# Altium project NORA_V0.01.PrjPcb
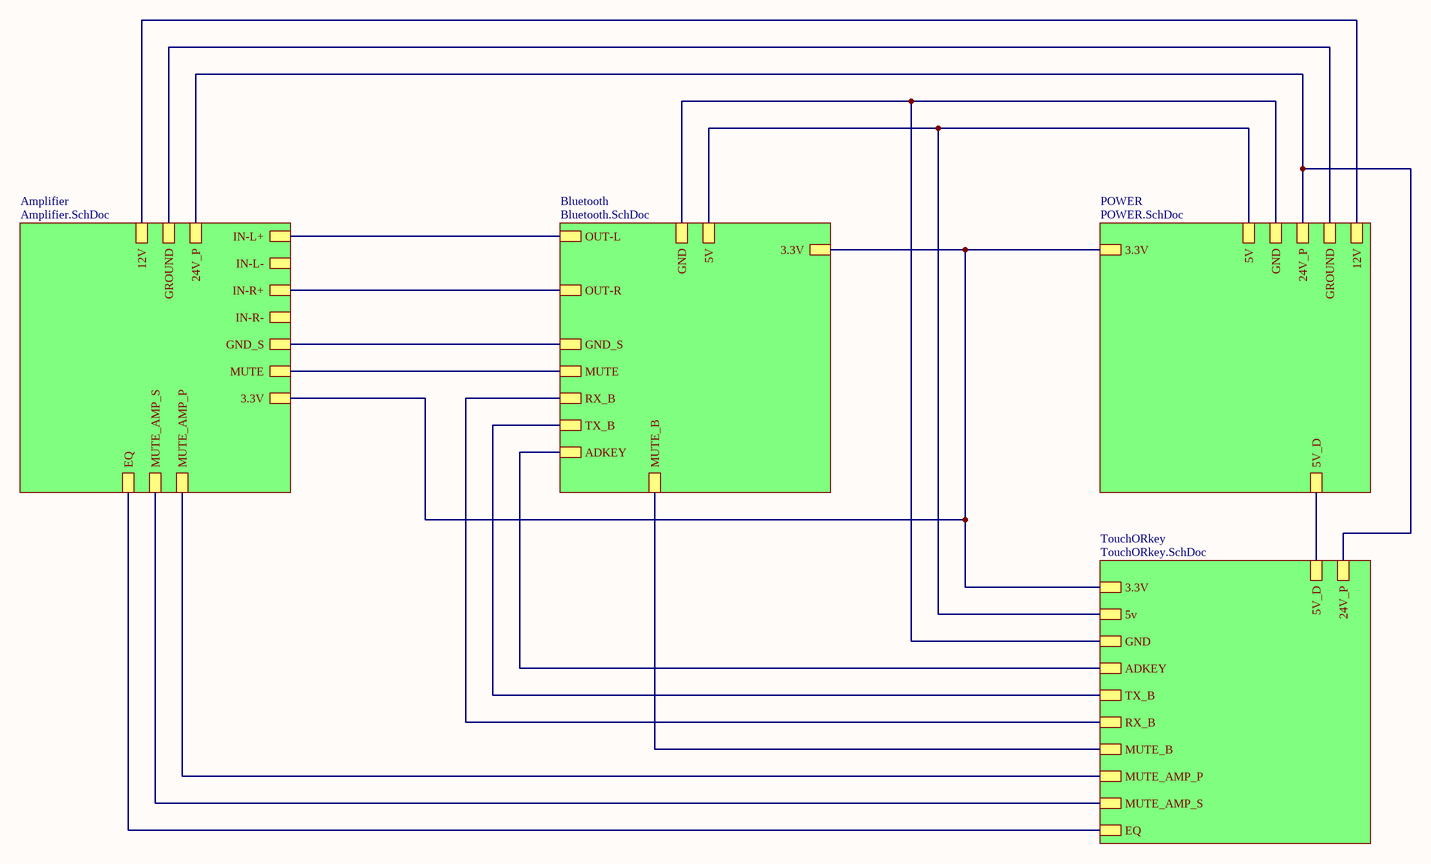
[diagram p0: NORA_V0.01.SchDoc]
5 sheets, 370 parts. Net scope: hierarchical (ports join the sheet entries above them; power ports are global).
Board files: NORA_V0.01-Pannel.PcbDoc, NORA_V0.01.PcbDoc
Sheets:
  NORA_V0.01.SchDoc
    Amplifier = Amplifier.SchDoc
    Bluetooth = Bluetooth.SchDoc
    POWER = POWER.SchDoc
    TouchORkey = TouchORkey.SchDoc

## Sheet NORA_V0.01.SchDoc
size A3; Value: 13nH

### Sub-sheets
Amplifier = Amplifier.SchDoc: IN-L+, IN-L-, IN-R+, IN-R-, MUTE, 24V_P, GROUND, GND_S, 3.3V, 12V, MUTE_AMP_P, MUTE_AMP_S, EQ
Bluetooth = Bluetooth.SchDoc: OUT-L, OUT-R, 3.3V, GND_S, GND, 5V, MUTE, RX_B, TX_B, ADKEY, MUTE_B
POWER = POWER.SchDoc: 3.3V, GND, 5V, 24V_P, GROUND, 12V, 5V_D
TouchORkey = TouchORkey.SchDoc: ADKEY, 3.3V, 5v, GND, TX_B, RX_B, 5V_D, 24V_P, MUTE_AMP_S, MUTE_B, MUTE_AMP_P, EQ

### Nets
3.3V: sheet Amplifier/3.3V, sheet Bluetooth/3.3V, sheet POWER/3.3V, sheet TouchORkey/3.3V
5V_D: sheet POWER/5V_D, sheet TouchORkey/5V_D
12V: sheet Amplifier/12V, sheet POWER/12V
24V_P: sheet Amplifier/24V_P, sheet POWER/24V_P, sheet TouchORkey/24V_P
AGND: sheet Amplifier/GND_S, sheet Bluetooth/GND_S
GND: sheet Amplifier/GROUND, sheet Bluetooth/GND, sheet POWER/GND, sheet POWER/GROUND, sheet TouchORkey/GND
VPWR: sheet Bluetooth/5V, sheet POWER/5V, sheet TouchORkey/5v
ADKEY: sheet Bluetooth/ADKEY, sheet TouchORkey/ADKEY
DACL: sheet Amplifier/IN-L+, sheet Bluetooth/OUT-L
DACR: sheet Amplifier/IN-R+, sheet Bluetooth/OUT-R
EQ: sheet Amplifier/EQ, sheet TouchORkey/EQ
IO0: sheet Bluetooth/MUTE_B, sheet TouchORkey/MUTE_B
IO3: sheet Amplifier/MUTE_AMP_P, sheet TouchORkey/MUTE_AMP_P
IO6: sheet Amplifier/MUTE_AMP_S, sheet TouchORkey/MUTE_AMP_S
IO20: sheet Bluetooth/TX_B, sheet TouchORkey/TX_B
IO21: sheet Bluetooth/RX_B, sheet TouchORkey/RX_B
MUTE: sheet Amplifier/MUTE, sheet Bluetooth/MUTE

### Notes on the sheet
- Title
- Size:
- Date:
- A3
- Number:
- Time:
- Revision:
- Sheet
- of
- File:

## Sheet Amplifier.SchDoc
size 863 x 558 mm
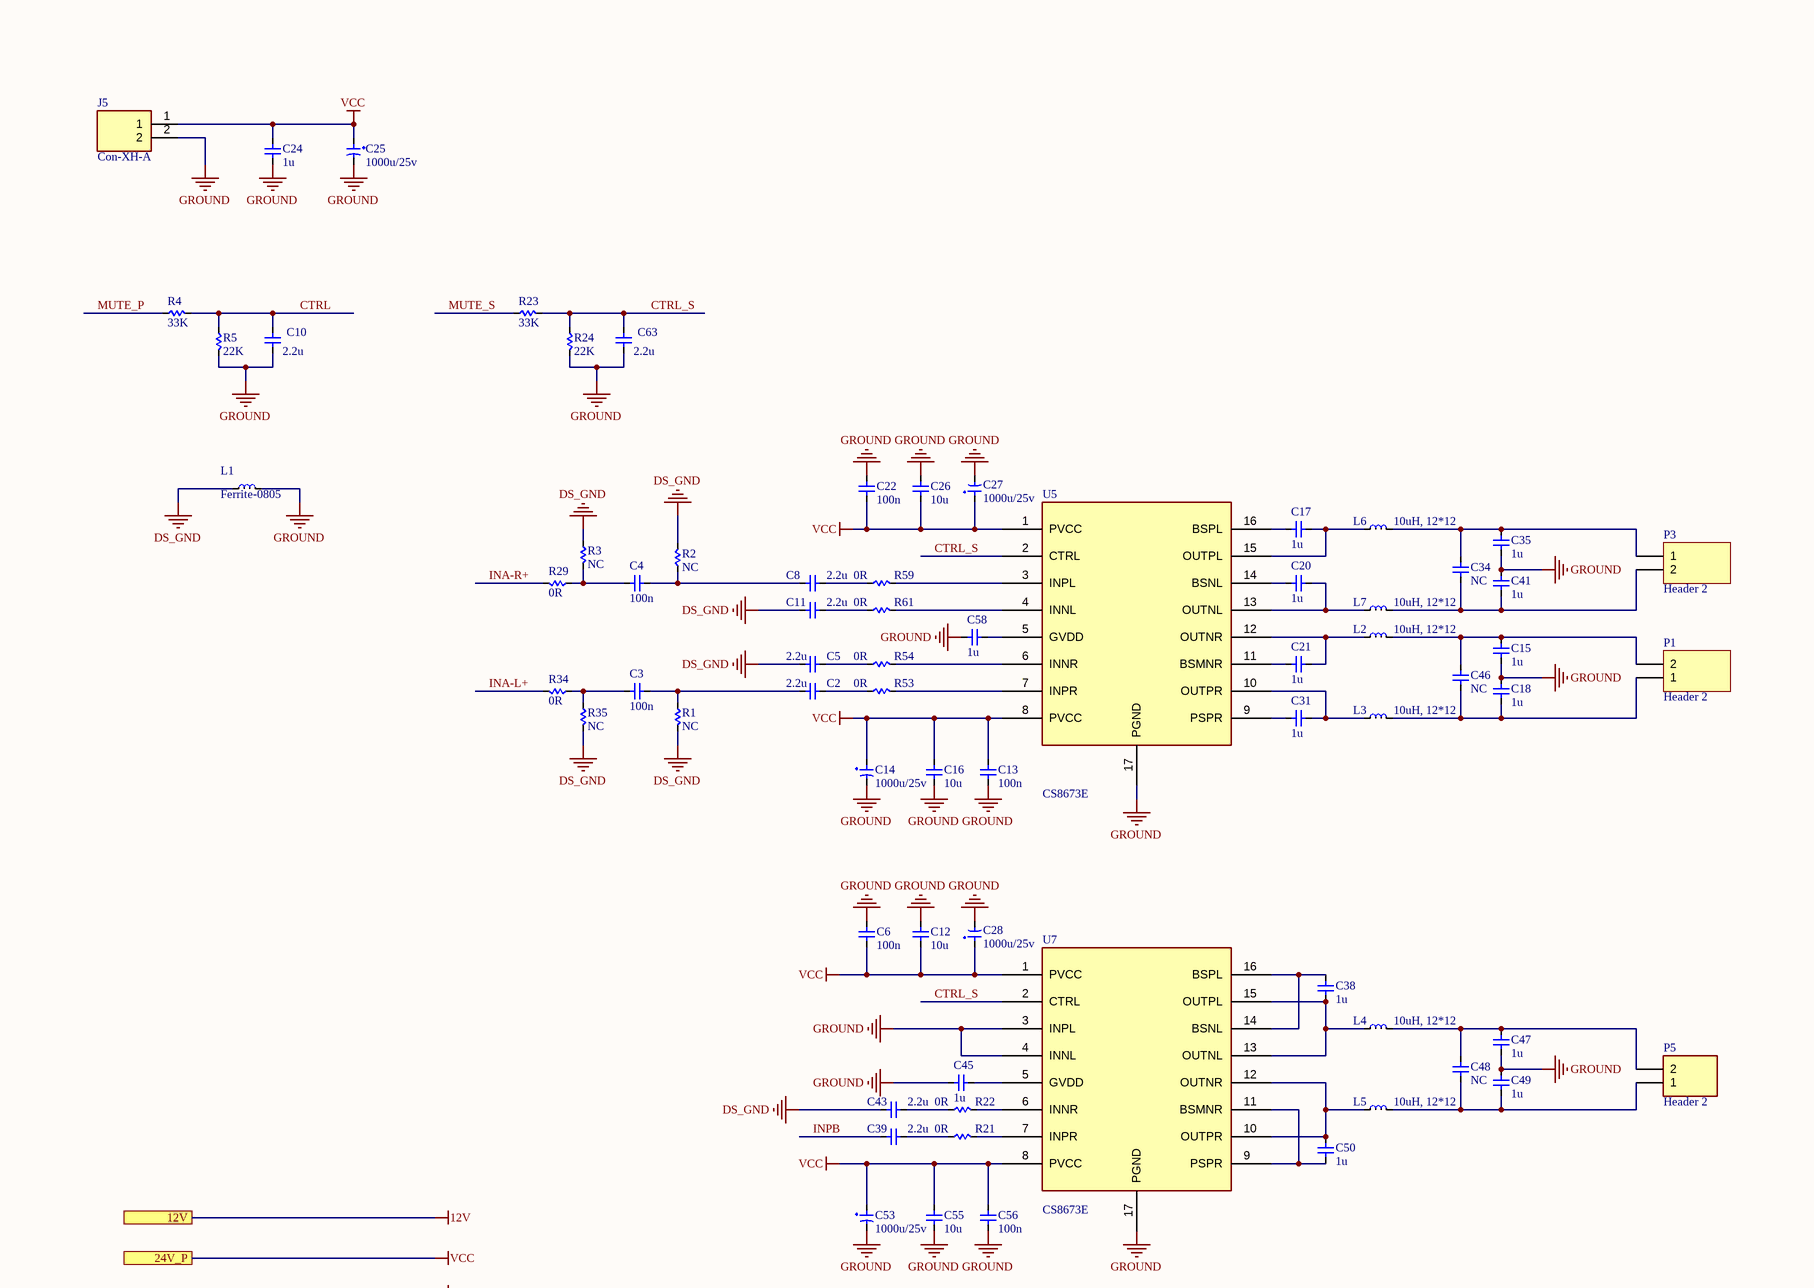
[diagram p1: Amplifier.SchDoc, top left]
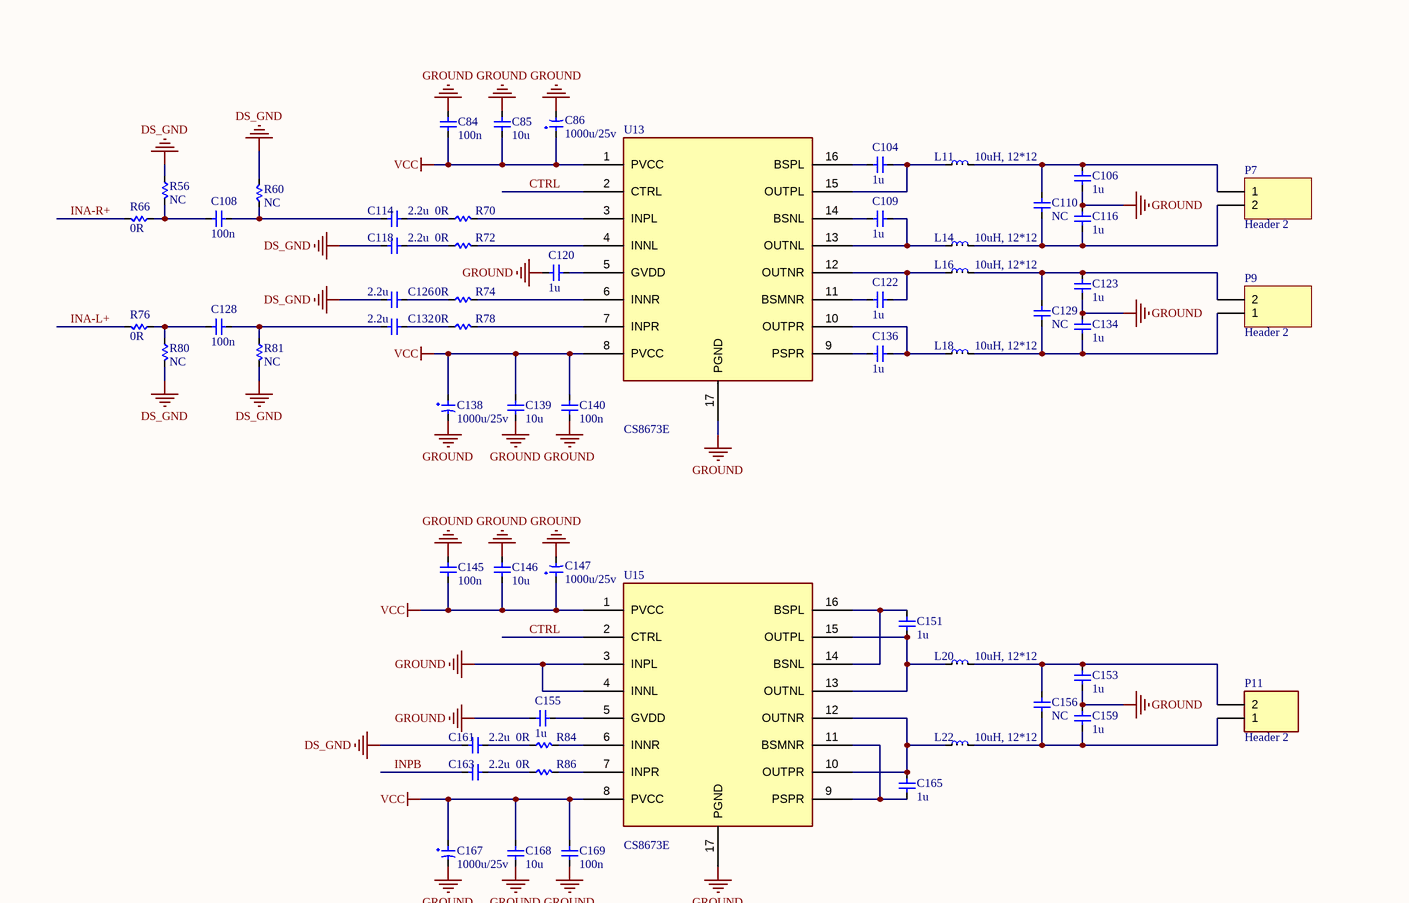
[diagram p2: Amplifier.SchDoc, top middle]
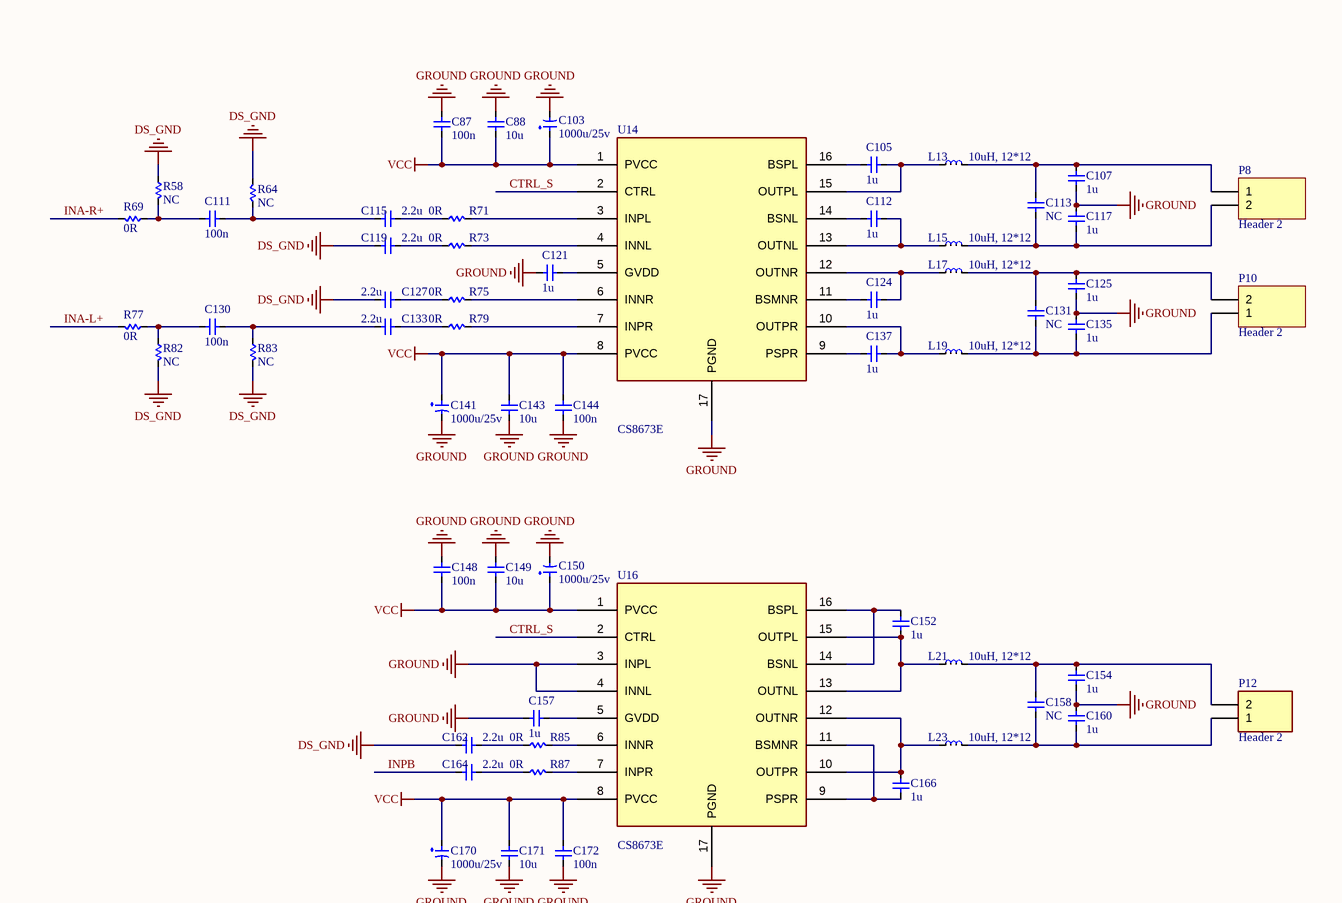
[diagram p3: Amplifier.SchDoc, top right]
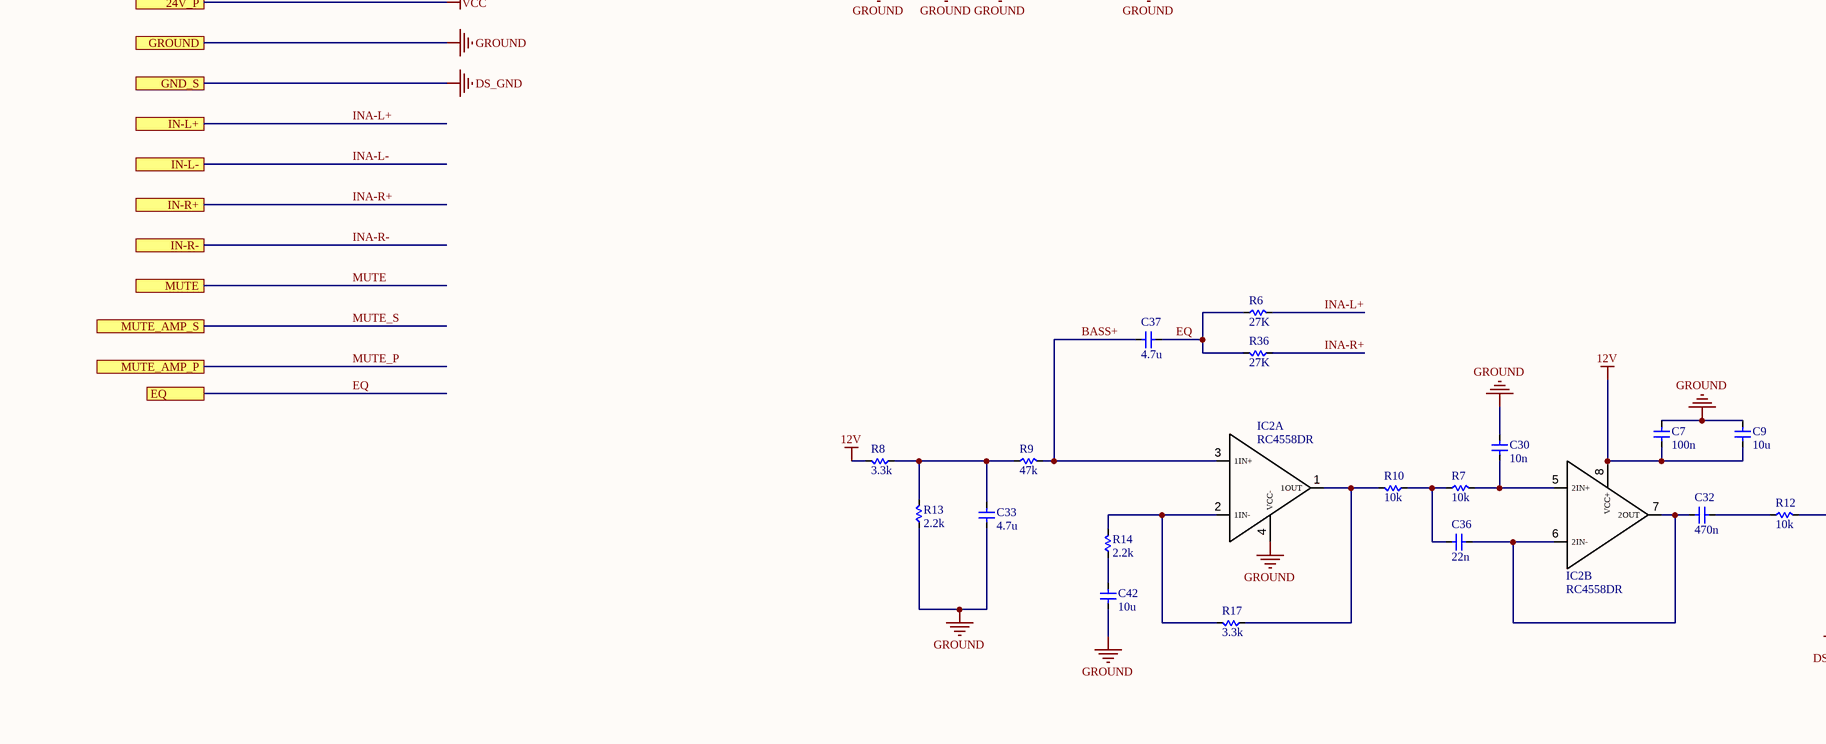
[diagram p4: Amplifier.SchDoc, bottom left]
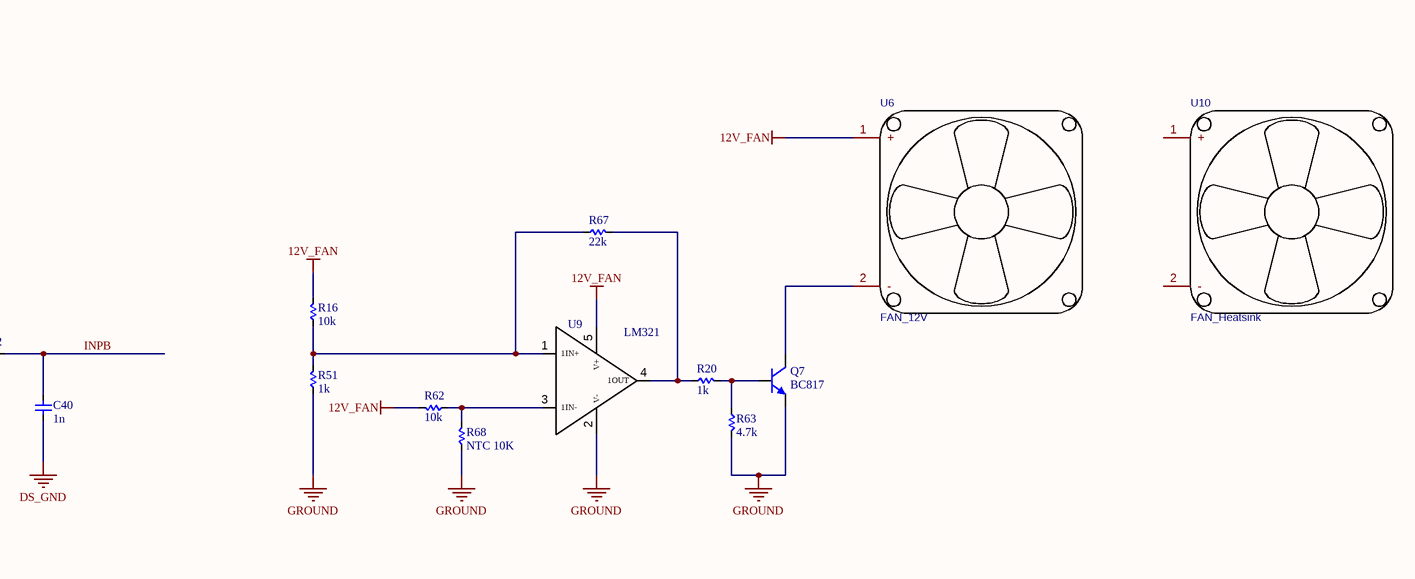
[diagram p5: Amplifier.SchDoc, bottom middle]

### Parts
C2  2.2u  [cap0603]
C3  100n  [cap0603]
C4  100n  [cap0603]
C5  2.2u  [cap0603]
C6  100n  [cap0603]
C7  100n  [cap0603]
C8  2.2u  [cap0603]
C9  10u  [cap0603]
C10  2.2u  [cap0603]
C11  2.2u  [cap0603]
C12  10u  [CAP 0805]
C13  100n  [cap0603]
C14  1000u/25v  [CAP DIP 10*13]
C15  1u  [CAP 0805]
C16  10u  [CAP 0805]
C17  1u  [CAP 0805]
C18  1u  [CAP 0805]
C20  1u  [CAP 0805]
C21  1u  [CAP 0805]
C22  100n  [cap0603]
C24  1u  [cap0603]
C25  1000u/25v  [CAP DIP 10*13]
C26  10u  [CAP 0805]
C27  1000u/25v  [CAP DIP 10*13]
C28  1000u/25v  [CAP DIP 10*13]
C30  10n  [cap0603]
C31  1u  [CAP 0805]
C32  470n  [cap0603]
C33  4.7u  [cap0603]
C34  NC  [CAP 0805]
C35  1u  [CAP 0805]
C36  22n  [cap0603]
C37  4.7u  [cap0603]
C38  1u  [CAP 0805]
C39  2.2u  [cap0603]
C40  1n  [cap0603]
C41  1u  [CAP 0805]
C42  10u  [CAP 1206]
C43  2.2u  [cap0603]
C45  1u  [cap0603]
C46  NC  [CAP 0805]
C47  1u  [CAP 0805]
C48  NC  [CAP 0805]
C49  1u  [CAP 0805]
C50  1u  [CAP 0805]
C53  1000u/25v  [CAP DIP 10*13]
C55  10u  [CAP 0805]
C56  100n  [cap0603]
C58  1u  [cap0603]
C63  2.2u  [cap0603]
C84  100n  [cap0603]
C85  10u  [CAP 0805]
C86  1000u/25v  [CAP DIP 10*13]
C87  100n  [cap0603]
C88  10u  [CAP 0805]
C103  1000u/25v  [CAP DIP 10*13]
C104  1u  [CAP 0805]
C105  1u  [CAP 0805]
C106  1u  [CAP 0805]
C107  1u  [CAP 0805]
C108  100n  [cap0603]
C109  1u  [CAP 0805]
C110  NC  [CAP 0805]
C111  100n  [cap0603]
C112  1u  [CAP 0805]
C113  NC  [CAP 0805]
C114  2.2u  [cap0603]
C115  2.2u  [cap0603]
C116  1u  [CAP 0805]
C117  1u  [CAP 0805]
C118  2.2u  [cap0603]
C119  2.2u  [cap0603]
C120  1u  [cap0603]
C121  1u  [cap0603]
C122  1u  [CAP 0805]
C123  1u  [CAP 0805]
C124  1u  [CAP 0805]
C125  1u  [CAP 0805]
C126  2.2u  [cap0603]
C127  2.2u  [cap0603]
C128  100n  [cap0603]
C129  NC  [CAP 0805]
C130  100n  [cap0603]
C131  NC  [CAP 0805]
C132  2.2u  [cap0603]
C133  2.2u  [cap0603]
C134  1u  [CAP 0805]
C135  1u  [CAP 0805]
C136  1u  [CAP 0805]
C137  1u  [CAP 0805]
C138  1000u/25v  [CAP DIP 10*13]
C139  10u  [CAP 0805]
C140  100n  [cap0603]
C141  1000u/25v  [CAP DIP 10*13]
C143  10u  [CAP 0805]
C144  100n  [cap0603]
C145  100n  [cap0603]
C146  10u  [CAP 0805]
C147  1000u/25v  [CAP DIP 10*13]
C148  100n  [cap0603]
C149  10u  [CAP 0805]
C150  1000u/25v  [CAP DIP 10*13]
C151  1u  [CAP 0805]
C152  1u  [CAP 0805]
C153  1u  [CAP 0805]
C154  1u  [CAP 0805]
C155  1u  [cap0603]
C156  NC  [CAP 0805]
C157  1u  [cap0603]
C158  NC  [CAP 0805]
C159  1u  [CAP 0805]
C160  1u  [CAP 0805]
C161  2.2u  [cap0603]
C162  2.2u  [cap0603]
C163  2.2u  [cap0603]
C164  2.2u  [cap0603]
C165  1u  [CAP 0805]
C166  1u  [CAP 0805]
C167  1000u/25v  [CAP DIP 10*13]
C168  10u  [CAP 0805]
C169  100n  [cap0603]
C170  1000u/25v  [CAP DIP 10*13]
C171  10u  [CAP 0805]
C172  100n  [cap0603]
IC2  RC4558DR  [RC4558]  (parts A,B of 2)
J5  Con-XH-A  [Con-JST_B2B-XH-A]
L1  Ferrite-0805  [Ferrite-0805]
L2  10uH, 12*12  [inductor 12*12]
L3  10uH, 12*12  [inductor 12*12]
L4  10uH, 12*12  [inductor 12*12]
L5  10uH, 12*12  [inductor 12*12]
L6  10uH, 12*12  [inductor 12*12]
L7  10uH, 12*12  [inductor 12*12]
L11  10uH, 12*12  [inductor 12*12]
L13  10uH, 12*12  [inductor 12*12]
L14  10uH, 12*12  [inductor 12*12]
L15  10uH, 12*12  [inductor 12*12]
L16  10uH, 12*12  [inductor 12*12]
L17  10uH, 12*12  [inductor 12*12]
L18  10uH, 12*12  [inductor 12*12]
L19  10uH, 12*12  [inductor 12*12]
L20  10uH, 12*12  [inductor 12*12]
L21  10uH, 12*12  [inductor 12*12]
L22  10uH, 12*12  [inductor 12*12]
L23  10uH, 12*12  [inductor 12*12]
P1  Header 2  [CONN-PHOENIX-5.08]
P3  Header 2  [CONN-PHOENIX-5.08]
P5  Header 2  [CONN-PHOENIX-3.81]
P7  Header 2  [CONN-PHOENIX-5.08]
P8  Header 2  [CONN-PHOENIX-5.08]
P9  Header 2  [CONN-PHOENIX-5.08]
P10  Header 2  [CONN-PHOENIX-5.08]
P11  Header 2  [CONN-PHOENIX-3.81]
P12  Header 2  [CONN-PHOENIX-3.81]
Q7  BC817  [BC817]
R1  NC  [RES-0603]
R2  NC  [RES-0603]
R3  NC  [RES-0603]
R4  33K  [RES-0603]
R5  22K  [RES-0603]
R6  27K  [RES-0603]
R7  10k  [RES-0603]
R8  3.3k  [RES-0603]
R9  47k  [RES-0603]
R10  10k  [RES-0603]
R12  10k  [RES-0603]
R13  2.2k  [RES-0603]
R14  2.2k  [RES-0603]
R16  10k  [RES-0603]
R17  3.3k  [RES-0603]
R20  1k  [RES-0603]
R21  0R  [RES-0603]
R22  0R  [RES-0603]
R23  33K  [RES-0603]
R24  22K  [RES-0603]
R29  0R  [RES-0603]
R34  0R  [RES-0603]
R35  NC  [RES-0603]
R36  27K  [RES-0603]
R51  1k  [RES-0603]
R53  0R  [RES-0603]
R54  0R  [RES-0603]
R56  NC  [RES-0603]
R58  NC  [RES-0603]
R59  0R  [RES-0603]
R60  NC  [RES-0603]
R61  0R  [RES-0603]
R62  10k  [RES-0603]
R63  4.7k  [RES-0603]
R64  NC  [RES-0603]
R66  0R  [RES-0603]
R67  22k  [RES-0603]
R68  NTC 10K  [RES-0805]
R69  0R  [RES-0603]
R70  0R  [RES-0603]
R71  0R  [RES-0603]
R72  0R  [RES-0603]
R73  0R  [RES-0603]
R74  0R  [RES-0603]
R75  0R  [RES-0603]
R76  0R  [RES-0603]
R77  0R  [RES-0603]
R78  0R  [RES-0603]
R79  0R  [RES-0603]
R80  NC  [RES-0603]
R81  NC  [RES-0603]
R82  NC  [RES-0603]
R83  NC  [RES-0603]
R84  0R  [RES-0603]
R85  0R  [RES-0603]
R86  0R  [RES-0603]
R87  0R  [RES-0603]
U5  CS8673E  [CS8673E]
U6  FAN_12V  [FAN_Connector XH]
U7  CS8673E  [CS8673E]
U9  LM321  [LM321]
U10  FAN_Heatsink  [FAN_Heatsink]
U13  CS8673E  [CS8673E]
U14  CS8673E  [CS8673E]
U15  CS8673E  [CS8673E]
U16  CS8673E  [CS8673E]

### Ports
12V, 24V_P, EQ, GND_S, GROUND, IN-L+, IN-L-, IN-R+, IN-R-, MUTE, MUTE_AMP_P, MUTE_AMP_S

### Nets
12V: C7.2 C9.1 IC2.8(VCC+) R8.2 ; port 12V
12V_FAN: R16.2 R62.2 U6.1(+) U9.5(V+)
DS_GND: C5.2 C11.2 C40.1 C43.2 C118.2 C119.2 C126.2 C127.2 C161.2 C162.2 L1.2 R1.2 R2.2 R3.1 R35.2 R56.1 R58.1 R60.2 R64.2 R80.2 R81.2 R82.2 R83.2 ; port GND_S  [project net AGND]
GROUND: C6.2 C7.1 C9.2 C10.1 C12.1 C13.2 C14.2(NEG) C15.1 C16.1 C18.2 C22.2 C24.2 C25.2(NEG) C26.1 C27.2(NEG) C28.2(NEG) C30.1 C33.1 C35.1 C41.2 C42.1 C45.1 C47.1 C49.2 C53.2(NEG) C55.1 C56.2 C58.1 C63.1 C84.2 C85.1 C86.2(NEG) C87.2 C88.1 C103.2(NEG) C106.1 C107.1 C116.2 C117.2 C120.1 C121.1 C123.1 C125.1 C134.2 C135.2 C138.2(NEG) C139.1 C140.2 C141.2(NEG) C143.1 C144.2 C145.2 C146.1 C147.2(NEG) C148.2 C149.1 C150.2(NEG) C153.1 C154.1 C155.1 C157.1 C159.2 C160.2 C167.2(NEG) C168.1 C169.2 C170.2(NEG) C171.1 C172.2 IC2.4(VCC-) J5.2 L1.1 Q7.2(E) R5.2 R13.1 R24.2 R51.1 R63.2 R68.1 U5.17(PGND) U7.3(INPL) U7.4(INNL) U7.17(PGND) U9.2(V-) U13.17(PGND) U14.17(PGND) U15.3(INPL) U15.4(INNL) U15.17(PGND) U16.3(INPL) U16.4(INNL) U16.17(PGND) ; port GROUND  [project net GND]
VCC: C6.1 C12.2 C13.1 C14.1(POS) C16.2 C22.1 C24.1 C25.1(POS) C26.2 C27.1(POS) C28.1(POS) C53.1(POS) C55.2 C56.1 C84.1 C85.2 C86.1(POS) C87.1 C88.2 C103.1(POS) C138.1(POS) C139.2 C140.1 C141.1(POS) C143.2 C144.1 C145.1 C146.2 C147.1(POS) C148.1 C149.2 C150.1(POS) C167.1(POS) C168.2 C169.1 C170.1(POS) C171.2 C172.1 J5.1 U5.1(PVCC) U5.8(PVCC) U7.1(PVCC) U7.8(PVCC) U13.1(PVCC) U13.8(PVCC) U14.1(PVCC) U14.8(PVCC) U15.1(PVCC) U15.8(PVCC) U16.1(PVCC) U16.8(PVCC) ; port 24V_P  [project net 24V_P]
BASS+: C37.1 IC2.3(1IN+) R9.2
CTRL: C10.2 R4.2 R5.1 U13.2(CTRL) U15.2(CTRL)
CTRL_S: C63.2 R23.2 R24.1 U5.2(CTRL) U7.2(CTRL) U14.2(CTRL) U16.2(CTRL)
EQ: C37.2 R6.1 R36.2 ; port EQ
INA-L+: R6.2 R34.2 R76.2 R77.2 ; port IN-L+  [project net DACL]
INA-L-: port IN-L-
INA-R+: R29.2 R36.1 R66.2 R69.2 ; port IN-R+  [project net DACR]
INA-R-: port IN-R-
INPB: C39.2 C40.2 C163.2 C164.2 R12.2
MUTE: port MUTE
MUTE_P: R4.1 ; port MUTE_AMP_P  [project net IO3]
MUTE_S: R23.1 ; port MUTE_AMP_S  [project net IO6]
NetC2_1: C2.1 C3.1 R1.1
NetC2_2: C2.2 R53.1
NetC3_2: C3.2 R34.1 R35.1
NetC4_1: C4.1 C8.2 R2.1
NetC4_2: C4.2 R3.2 R29.1
NetC5_1: C5.1 R54.1
NetC8_1: C8.1 R59.1
NetC11_1: C11.1 R61.1
NetC15_2: C15.2 C46.2 L2.1 P1.2
NetC17_1: C17.1 L6.2 U5.15(OUTPL)
NetC17_2: C17.2 U5.16(BSPL)
NetC18_1: C18.1 C46.1 L3.1 P1.1
NetC20_1: C20.1 L7.2 U5.13(OUTNL)
NetC20_2: C20.2 U5.14(BSNL)
NetC21_1: C21.1 L2.2 U5.12(OUTNR)
NetC21_2: C21.2 U5.11(BSMNR)
NetC30_2: C30.2 IC2.5(2IN+) R7.2
NetC31_1: C31.1 L3.2 U5.10(OUTPR)
NetC31_2: C31.2 U5.9(PSPR)
NetC32_1: C32.1 C36.1 IC2.6(2IN-) IC2.7(2OUT)
NetC32_2: C32.2 R12.1
NetC33_2: C33.2 R8.1 R9.1 R13.2
NetC34_1: C34.1 C41.1 L7.1 P3.2
NetC34_2: C34.2 C35.2 L6.1 P3.1
NetC36_2: C36.2 R7.1 R10.1
NetC38_1: C38.1 L4.2 U7.13(OUTNL) U7.15(OUTPL)
NetC38_2: C38.2 U7.14(BSNL) U7.16(BSPL)
NetC39_1: C39.1 R21.1
NetC42_2: C42.2 R14.1
NetC43_1: C43.1 R22.1
NetC45_2: C45.2 U7.5(GVDD)
NetC47_2: C47.2 C48.2 L4.1 P5.2
NetC48_1: C48.1 C49.1 L5.1 P5.1
NetC50_1: C50.1 L5.2 U7.10(OUTPR) U7.12(OUTNR)
NetC50_2: C50.2 U7.9(PSPR) U7.11(BSMNR)
NetC58_2: C58.2 U5.5(GVDD)
NetC104_1: C104.1 L11.2 U13.15(OUTPL)
NetC104_2: C104.2 U13.16(BSPL)
NetC105_1: C105.1 L13.2 U14.15(OUTPL)
NetC105_2: C105.2 U14.16(BSPL)
NetC106_2: C106.2 C110.2 L11.1 P7.1
NetC107_2: C107.2 C113.2 L13.1 P8.1
NetC108_1: C108.1 C114.2 R60.1
NetC108_2: C108.2 R56.2 R66.1
NetC109_1: C109.1 L14.2 U13.13(OUTNL)
NetC109_2: C109.2 U13.14(BSNL)
NetC110_1: C110.1 C116.1 L14.1 P7.2
NetC111_1: C111.1 C115.2 R64.1
NetC111_2: C111.2 R58.2 R69.1
NetC112_1: C112.1 L15.2 U14.13(OUTNL)
NetC112_2: C112.2 U14.14(BSNL)
NetC113_1: C113.1 C117.1 L15.1 P8.2
NetC114_1: C114.1 R70.1
NetC115_1: C115.1 R71.1
NetC118_1: C118.1 R72.1
NetC119_1: C119.1 R73.1
NetC120_2: C120.2 U13.5(GVDD)
NetC121_2: C121.2 U14.5(GVDD)
NetC122_1: C122.1 L16.2 U13.12(OUTNR)
NetC122_2: C122.2 U13.11(BSMNR)
NetC123_2: C123.2 C129.2 L16.1 P9.2
NetC124_1: C124.1 L17.2 U14.12(OUTNR)
NetC124_2: C124.2 U14.11(BSMNR)
NetC125_2: C125.2 C131.2 L17.1 P10.2
NetC126_1: C126.1 R74.1
NetC127_1: C127.1 R75.1
NetC128_1: C128.1 C132.1 R81.1
NetC128_2: C128.2 R76.1 R80.1
NetC129_1: C129.1 C134.1 L18.1 P9.1
NetC130_1: C130.1 C133.1 R83.1
NetC130_2: C130.2 R77.1 R82.1
NetC131_1: C131.1 C135.1 L19.1 P10.1
NetC132_2: C132.2 R78.1
NetC133_2: C133.2 R79.1
NetC136_1: C136.1 L18.2 U13.10(OUTPR)
NetC136_2: C136.2 U13.9(PSPR)
NetC137_1: C137.1 L19.2 U14.10(OUTPR)
NetC137_2: C137.2 U14.9(PSPR)
NetC151_1: C151.1 L20.2 U15.13(OUTNL) U15.15(OUTPL)
NetC151_2: C151.2 U15.14(BSNL) U15.16(BSPL)
NetC152_1: C152.1 L21.2 U16.13(OUTNL) U16.15(OUTPL)
NetC152_2: C152.2 U16.14(BSNL) U16.16(BSPL)
NetC153_2: C153.2 C156.2 L20.1 P11.2
NetC154_2: C154.2 C158.2 L21.1 P12.2
NetC155_2: C155.2 U15.5(GVDD)
NetC156_1: C156.1 C159.1 L22.1 P11.1
NetC157_2: C157.2 U16.5(GVDD)
NetC158_1: C158.1 C160.1 L23.1 P12.1
NetC161_1: C161.1 R84.1
NetC162_1: C162.1 R85.1
NetC163_1: C163.1 R86.1
NetC164_1: C164.1 R87.1
NetC165_1: C165.1 L22.2 U15.10(OUTPR) U15.12(OUTNR)
NetC165_2: C165.2 U15.9(PSPR) U15.11(BSMNR)
NetC166_1: C166.1 L23.2 U16.10(OUTPR) U16.12(OUTNR)
NetC166_2: C166.2 U16.9(PSPR) U16.11(BSMNR)
NetIC2_1: IC2.1(1OUT) R10.2 R17.1
NetIC2_2: IC2.2(1IN-) R14.2 R17.2
NetQ7_1: Q7.1(B) R20.2 R63.1
NetQ7_3: Q7.3(C) U6.2(-)
NetR16_1: R16.1 R51.2 R67.1 U9.1(1IN+)
NetR20_1: R20.1 R67.2 U9.4(1OUT)
NetR21_2: R21.2 U7.7(INPR)
NetR22_2: R22.2 U7.6(INNR)
NetR53_2: R53.2 U5.7(INPR)
NetR54_2: R54.2 U5.6(INNR)
NetR59_2: R59.2 U5.3(INPL)
NetR61_2: R61.2 U5.4(INNL)
NetR62_1: R62.1 R68.2 U9.3(1IN-)
NetR70_2: R70.2 U13.3(INPL)
NetR71_2: R71.2 U14.3(INPL)
NetR72_2: R72.2 U13.4(INNL)
NetR73_2: R73.2 U14.4(INNL)
NetR74_2: R74.2 U13.6(INNR)
NetR75_2: R75.2 U14.6(INNR)
NetR78_2: R78.2 U13.7(INPR)
NetR79_2: R79.2 U14.7(INPR)
NetR84_2: R84.2 U15.6(INNR)
NetR85_2: R85.2 U16.6(INNR)
NetR86_2: R86.2 U15.7(INPR)
NetR87_2: R87.2 U16.7(INPR)

Not connected (* = marked no-connect by the designer): U10 1(+) 2(-)

### Notes on the sheet
- DWG. NO.
- REV.
- SHT.
- REVISION
- DESCRIPTION
- DATE
- APPROVED
- THIS DOCUMENT AND THE DATA DISCLOSED HEREIN OR HEREWITH IS THE PROPERTY OF ALTIUM LIMITED AND MAY BE FREELY DISTRIBUTED IN WHOLE. NO RIGHTS ARE RESERVED OR EXPRESS OR IMPLIED WARANTEE GIVEN.
- ENG:
- DSN:
- APPROVALS
- PROJECT
- DOCUMENT REVISION:
- DESIGN ITEM:
- CHK:
- BOM:
- REFERENCE DOCUMENTS
- PROJECT REVISION:
- TITLE
- FAB DWG:
- PCB DWG:
- ASSY DWG:
- SCALE:
- SIZE
- D
- CAGE CODE
- FILE NAME
- DWG NO.
- SHEET
- OF
- REV

### Library data of the parts
C2 C5-C8 C11 C13 C22 C24 C30 C32 C36 C39 C40 C43 C45 C56 C58 C84 C87 C114 C115 C118-C121 C126 C127 C132 C133 C140 C144 C145 C148 C155 C157 C161-C164 C169 C172 = Cap 0603: Capacitor 0603; Published: 8-Jun-2000; LatestRevisionDate: 17-Jul-2002; LatestRevisionNote: Re-released for DXP Platform.; Publisher: Altium Limited; Value: *
C3 C4 C9 C10 C33 C37 C63 C108 C111 C128 C130 = Cap 0603: Capacitor 0603; Value: 104; Published: 8-Jun-2000; LatestRevisionDate: 17-Jul-2002; LatestRevisionNote: Re-released for DXP Platform.; Publisher: Altium Limited
C12 C15-C18 C20 C21 C26 C31 C34 C35 C38 C41 C46-C50 C55 C85 C88 C104-C107 C109 C110 C112 C113 C116 C117 C122-C125 C129 C131 C134-C137 C139 C143 C146 C149 C151-C154 C156 C158-C160 C165 C166 C168 C171 = Cap 0805: Capacitor 0805; Value: 104; Published: 8-Jun-2000; LatestRevisionDate: 17-Jul-2002; LatestRevisionNote: Re-released for DXP Platform.; Publisher: Altium Limited
C14 C25 C27 C28 C53 C86 C103 C138 C141 C147 C150 C167 C170 = capacitor dip 10*13: 2200ÂµF 50V Aluminum Electrolytic Capacitors Radial, Can 1000 Hrs @ 105Â°C; MF: Nichicon; MP: UVZ1H222MHD; Package: Radial Nichicon; Value: *; Price: None; SnapEDA_Link: https://www.snapeda.com/parts/UVZ1H222MHD/Nichicon/view-part/468437/?ref=snap; Availability: Unavailable
C42 = Cap 1206: Capacitor 1206; Value: 104; Published: 8-Jun-2000; LatestRevisionDate: 17-Jul-2002; LatestRevisionNote: Re-released for DXP Platform.; Publisher: Altium Limited
IC2 = RC4558DR: Integrated Circuit SOIC 8; Manufacturer_Name: Texas Instruments; Datasheet Link: http://www.ti.com/lit/gpn/rc4558; Height: 1.75mm; Manufacturer_Part_Number: RC4558DR; Arrow Part Number: RC4558DR; Arrow Price/Stock: https://www.arrow.com/en/products/rc4558dr/texas-instruments; Mouser Part Number: 595-RC4558DR; Mouser Price/Stock: https://www.mouser.co.uk/ProductDetail/Texas-Instruments/RC4558DR?qs=DXdcjUGny5OhrzskaZRdew%3D%3D
J5 = Con-B2B-XH-A: Connector Header Through Hole 2 position 0.098 _2.50mm_; MP: B2B-XH-A_LF__SN_; MF: JST Sales; Price: None; Package: None; Value: *; Availability: Unavailable; SnapEDA_Link: https://www.snapeda.com/parts/B2B-XH-A%28LF%29%28SN%29/JST%20Sales%20America%20Inc./view-part/492310/?ref=snap
L1 = Ferrite _0805: BLM Series 0805 330 Ohm 400 mA 0.58 Ohm DCR Surface Mount Ferrite Bead; MF: Murata; MP: BLM18BB331SN1D; Package: 0603 Murata; Price: None; Availability: Unavailable; SnapEDA_Link: https://www.snapeda.com/parts/BLM18BB331SN1D/Murata%20Electronics%20North%20America/view-part/?ref=snap; Value: *
L2-L7 L11 L13-L23 = INDUCTOR 12*12: Inductor round 12*12; MP: DR127-330-R; MF: Eaton; Price: None; Package: Nonstandard Eaton; Availability: Unavailable; SnapEDA_Link: https://www.snapeda.com/parts/DR127-330-R/Eaton/view-part/?ref=snap; Value: *
P1 P3 P7-P10 = CONN-Phoenix-5.08: Phoenix Connector 5.08; LatestRevisionDate: 17-Jul-2002; LatestRevisionNote: Re-released for DXP Platform.; Publisher: Altium Limited
P5 P11 P12 = CONN-Phoenix-3.81_1: Phoenix Connector 3.81; LatestRevisionDate: 17-Jul-2002; LatestRevisionNote: Re-released for DXP Platform.; Publisher: Altium Limited
Q7 = BC817: NPN General Purpose Amplifier BJT; Published: 8-Jun-2000; LatestRevisionDate: 15-Jan-2003; LatestRevisionNote: PCB Footprint 'BCY-W3/D4.7' replaced; DatasheetVersion: 1997; PackageVersion: Sep-1998; PackageReference: TO-92A; Publisher: Altium Limited; PackageDescription: TO, Flat Index; 3 In-Line, Axial Leads; Body Dia. 4.5mm; Leads 0.51 x 0.48 mm (max); ComponentLink1Description: Manufacturer Link; ComponentLink1URL: http://www.fairchildsemi.com/; ComponentLink2Description: Datasheet; ComponentLink2URL: http://www.fairchildsemi.com/ds/2N%2F2N3904.pdf
R1-R3 R29 R34 R35 R56 R58 R60 R64 R66 R69 R76 R77 R80-R83 = Res 0603: Resistor 0603; Value: 3.3k; Published: 8-Jun-2000; LatestRevisionDate: 29-May-2009; LatestRevisionNote: IPC-7351 Footprint Added.; PackageReference: J1-0603; Publisher: Altium Limited; PackageDescription: Chip Resistor
R4-R10 R12-R14 R16 R17 R20-R24 R36 R51 R53 R54 R59 R61-R63 R67 R70-R75 R78 R79 R84-R87 = Res 0603: Resistor 0603; Published: 8-Jun-2000; LatestRevisionDate: 29-May-2009; LatestRevisionNote: IPC-7351 Footprint Added.; PackageReference: J1-0603; Publisher: Altium Limited; PackageDescription: Chip Resistor
  R4-R10 R12-R14 R17 R23 R24 R36: Value: *
R68 = Res 0805: resistor 0805
U5 U7 U13-U16 = CS8673E: AB/D 2X40W BTL & 80W PBTL ESOP16; Manufacturer_Name: Chipstar; Manufacturer_Part_Number: CS8679E; Height: 2.47mm; Arrow Part Number: CS8679E; Arrow Price/Stock: https://www.arrow.com/en/products/tda7491hv13tr/stmicroelectronics; Mouser Part Number: 511-TDA7491HV13TR; Mouser Price/Stock: https://www.mouser.com/Search/Refine.aspx?Keyword=511-TDA7491HV13TR
U6 = FAN_12V: FAN 12V 40*40*10mm . XH Connector; Contributor: novasilisko; timeStamp: 1467237407; Manufacturer Part: ?; spicePre: U
U9 = LM321: Operational Amplifier 5-SOT-23; MP: OPA354AIDBVT; MF: Texas Instruments; Package: SOT-23-5 Texas Instruments; Digi-Key_Purchase_URL: https://www.digikey.de/product-detail/en/texas-instruments/OPA354AIDBVT/296-13033-1-ND/480149?utm_source=snapeda&utm_medium=aggregator&utm_campaign=symbol; SnapEDA_Link: https://www.snapeda.com/parts/OPA354AIDBVT/Texas%20Instruments/view-part/?ref=snap; Digi-Key_Part_Number: 296-13033-1-ND; Value: *
U10 = FAN_Heatsink: 55mm Aluminum Heatsink with Cooling Fan; Contributor: novasilisko; timeStamp: 1467237407; Manufacturer Part: ?; spicePre: U

## Sheet Bluetooth.SchDoc
size A3 portrait
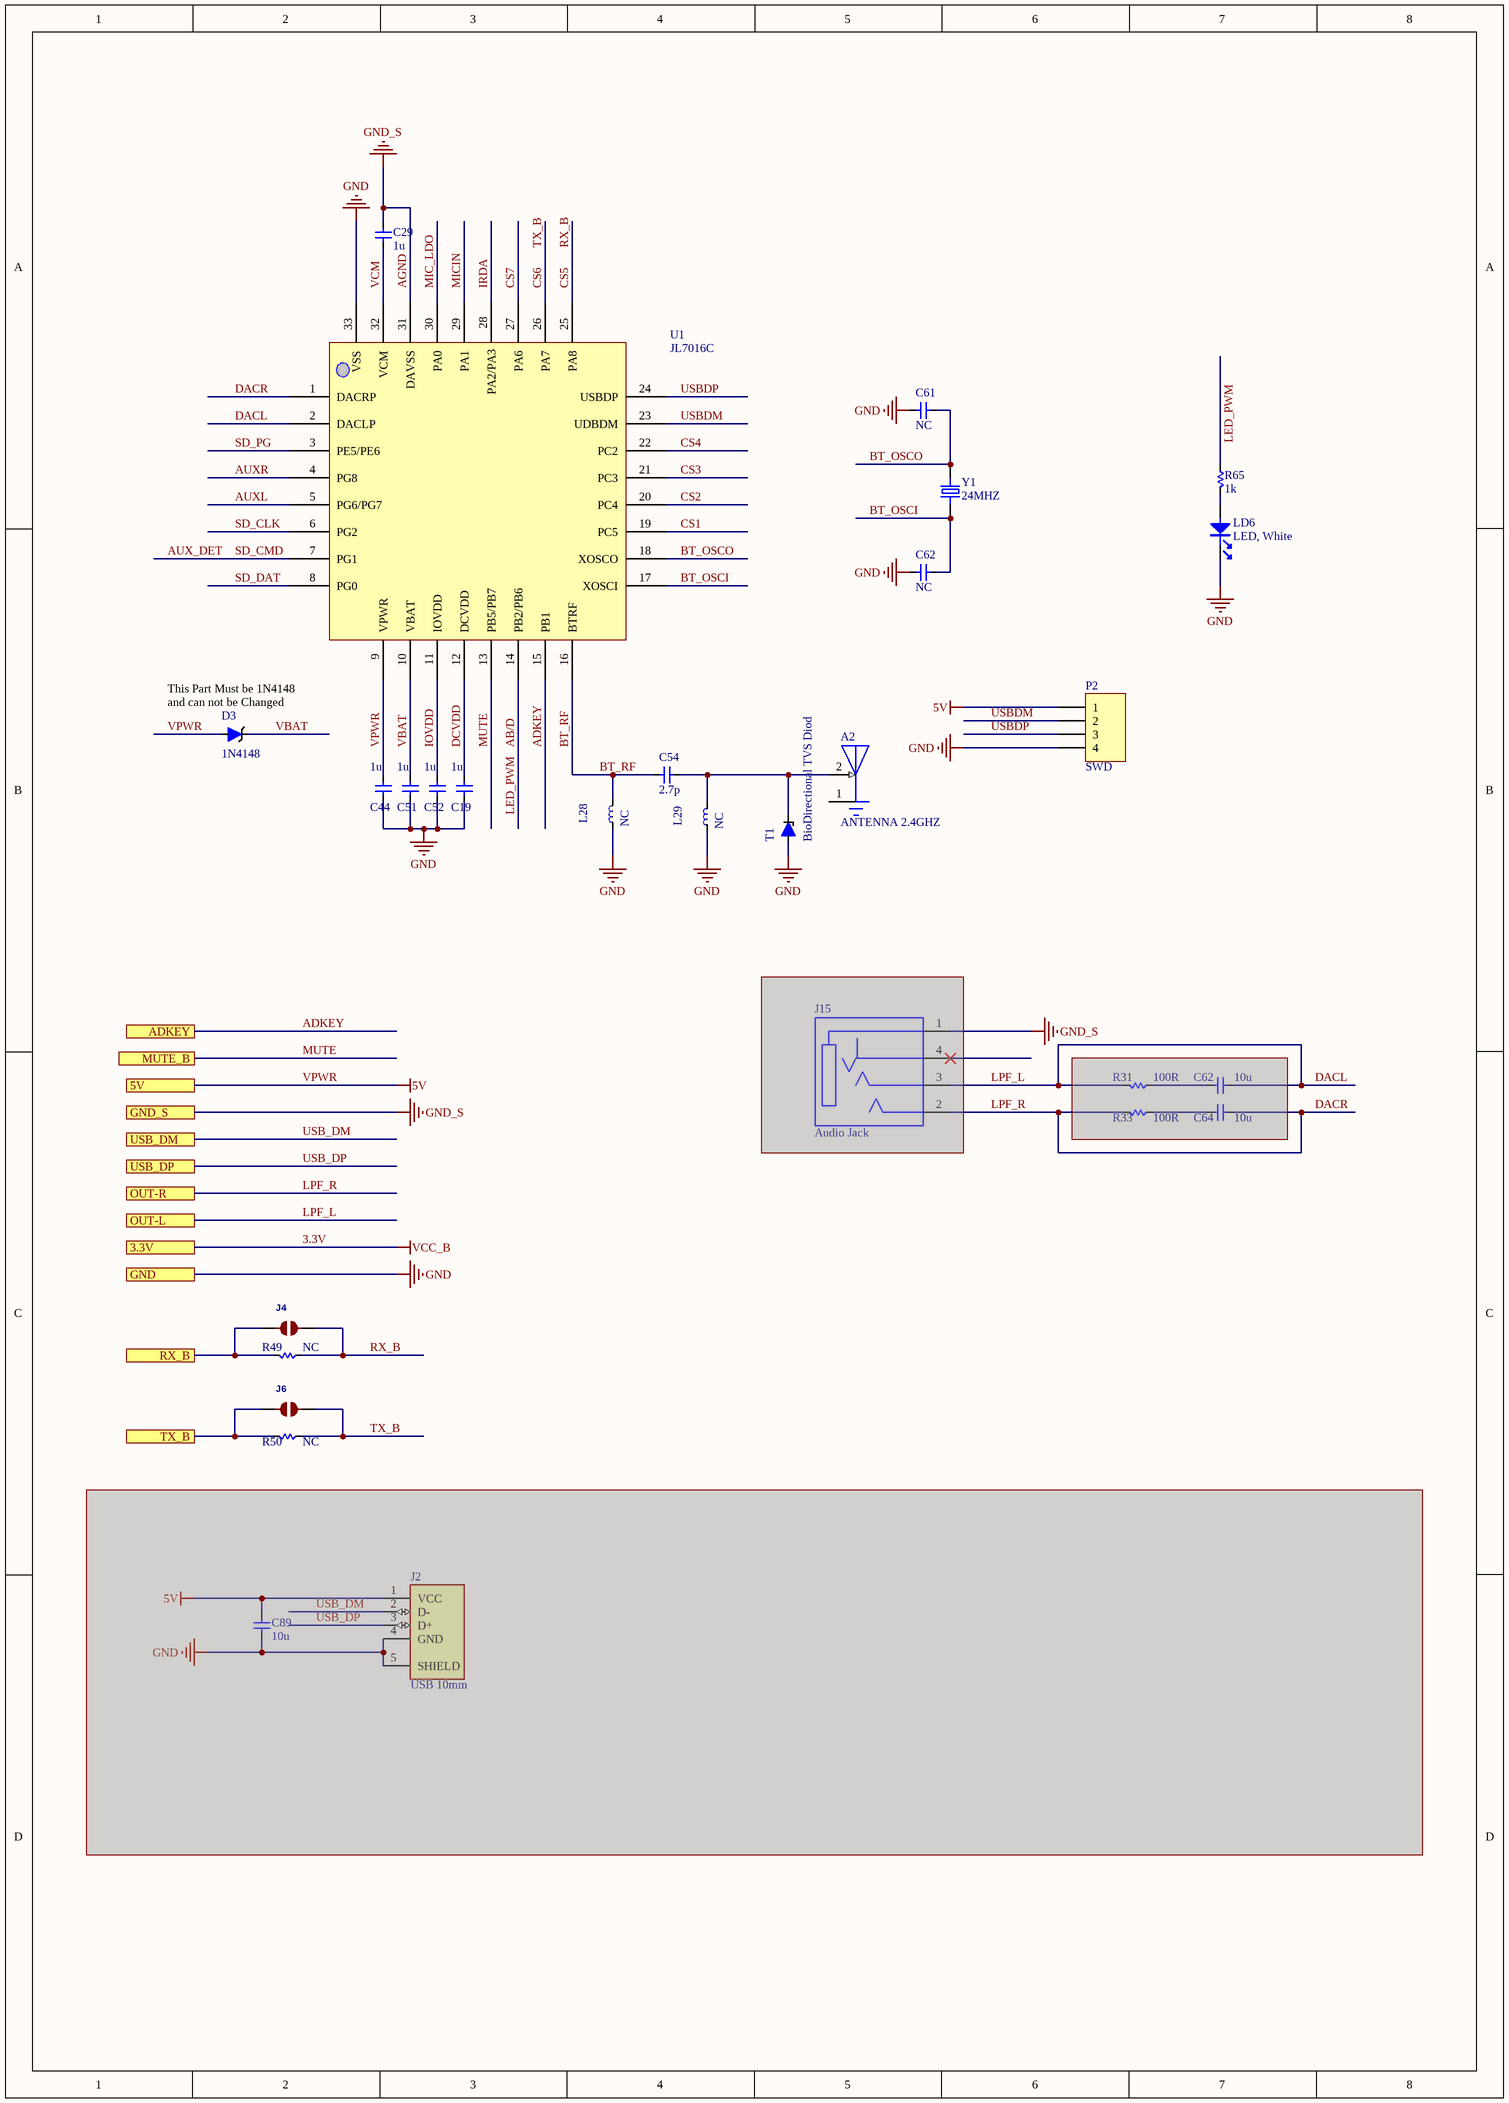
[diagram p6: Bluetooth.SchDoc]

### Parts
(Parts that share a designator on the sheet are numbered #1, #2 ... from top to bottom, then left to right.)
A2  ANTENNA 2.4GHZ  [ANTENNA 2.4GHZ - TI]
C19  1u  [cap0603]
C29  1u  [cap0603]
C44  1u  [cap0603]
C51  1u  [cap0603]
C52  1u  [cap0603]
C54  2.7p  [cap0603]
C61  NC  [cap0603]
C62#1  NC  [cap0603]
C62#2  10u  [CAP 0805]  (masked out: inside a compile mask, not in the netlist)
C64#1  10u  [CAP 0805]  (masked out: inside a compile mask, not in the netlist)
C89  10u  [CAP 0805]  (masked out: inside a compile mask, not in the netlist)
D3  1N4148  [1N4148 SOD-123]
J2#1  USB 10mm  [USB SMALL]  (masked out: inside a compile mask, not in the netlist)
J4  SOLDERJUMPER  [SOLDERJUMPER_ARROW_NOPASTE]  (value not drawn)
J6  SOLDERJUMPER  [SOLDERJUMPER_ARROW_NOPASTE]  (value not drawn)
J15  Audio Jack  [Audio jack_ CUI_SJ2-3574A-SMT-TR]  (masked out: inside a compile mask, not in the netlist)
L28  NC  [inductor 0603]
L29  NC  [inductor 0603]
LD6  LED, White  [LED-0603-BLUE]
P2  SWD  [HDR1X4H]
R31#1  100R  [RES-0603]  (masked out: inside a compile mask, not in the netlist)
R33#1  100R  [RES-0603]  (masked out: inside a compile mask, not in the netlist)
R49  NC  [RES-0603]
R50  NC  [RES-0603]
R65  1k  [RES-0603]
T1  BioDirectional TVS Diod  [SMAJ3.3A]
U1  JL7016C  [JL7016C]
Y1  24MHZ  [crystal b]

### Ports
3.3V, 5V, ADKEY, GND, GND_S, MUTE_B, OUT-L, OUT-R, RX_B, TX_B, USB_DM, USB_DP

### Nets
AGND: C29.2 U1.31(DAVSS) ; port GND_S  [also labelled GND_S]
GND: C19.2 C44.2 C51.2 C52.2 C61.1 C62#1.2 L28.2 L29.2 LD6.1 P2.4 T1.A U1.33(VSS) ; port GND
VPWR: C44.1 D3.1(A) P2.1 U1.9(VPWR) ; port 5V  [also labelled 5V]
AB/D: R65.1 U1.14(PB2/PB6)  [also labelled LED_PWM]
ADKEY: U1.15(PB1) ; port ADKEY
AUX_DET: U1.7(PG1)  [also labelled SD_CMD]
AUXL: U1.5(PG6/PG7)
AUXR: U1.4(PG8)
BT_OSCI: C62#1.1 U1.17(XOSCI) Y1.1
BT_OSCO: C61.2 U1.18(XOSCO) Y1.2
BT_RF: C54.2 L28.1 U1.16(BTRF)
CS1: U1.19(PC5)
CS2: U1.20(PC4)
CS3: U1.21(PC3)
CS4: U1.22(PC2)
CS5: J4.2 R49.1 U1.25(PA8)  [also labelled RX_B]
CS6: J6.2 R50.1 U1.26(PA7)  [also labelled TX_B]
CS7: U1.27(PA6)
DACL: U1.2(DACLP) ; port OUT-L  [also labelled LPF_L]
DACR: U1.1(DACRP) ; port OUT-R  [also labelled LPF_R]
DCVDD: C19.1 U1.12(DCVDD)
IO20: J6.1 R50.2 ; port TX_B
IO21: J4.1 R49.2 ; port RX_B
IOVDD: C52.1 U1.11(IOVDD)
IRDA: U1.28(PA2/PA3)
MIC_LDO: U1.30(PA0)
MICIN: U1.29(PA1)
MUTE: U1.13(PB5/PB7) ; port MUTE_B  [project net IO0]
SD_CLK: U1.6(PG2)
SD_DAT: U1.8(PG0)
SD_PG: U1.3(PE5/PE6)
USB_DM: port USB_DM
USB_DP: port USB_DP
USBDM: P2.2 U1.23(UDBDM)
USBDP: P2.3 U1.24(USBDP)
VBAT: C51.1 D3.2(C) U1.10(VBAT)
VCM: C29.1 U1.32(VCM)
NetA2_2: A2.2(FEED) C54.1 L29.1 T1.C
NetLD6_2: LD6.2 R65.2

Not connected (* = marked no-connect by the designer): A2 1(GND)

### Notes on the sheet
- (near D3) This Part Must be 1N4148 and can not be Changed
- Title
- Size:
- Date:
- File:
- A2
- Number:
- Time:
- Revision:
- Sheet
- of

### Library data of the parts
A2 = ANTENNA 2.4GHZ: ESP32 ANTENNA; MP: PRO-OB-440; MF: Proant AB; SnapEDA_Link: https://www.snapeda.com/parts/PRO-OB-440/Proant%20AB/view-part/2307534/?ref=snap; Digi-Key_Purchase_URL: https://www.digikey.com/product-detail/en/proant-ab/PRO-OB-440/1532-1001-1-ND/4895684?utm_source=snapeda&utm_medium=aggregator&utm_campaign=symbol; Value: *; Package: None; Digi-Key_Part_Number: 1532-1001-1-ND
C19 C29 C44 C51 C52 C54 C61 C62#1 = Cap 0603: Capacitor 0603; Value: 104; Published: 8-Jun-2000; LatestRevisionDate: 17-Jul-2002; LatestRevisionNote: Re-released for DXP Platform.; Publisher: Altium Limited
C62#2 C64#1 C89 = Cap 0805: Capacitor 0805; Value: 104; Published: 8-Jun-2000; LatestRevisionDate: 17-Jul-2002; LatestRevisionNote: Re-released for DXP Platform.; Publisher: Altium Limited
D3 = 1N4148_SOD123: SOD-123 Package; MP: EDZV12B; MF: ROHM Semiconductor; Price: None; Package: None; SnapEDA_Link: https://www.snapeda.com/parts/EDZV12B/EMI/view-part/4479349/?ref=snap; Availability: Unavailable; Value: *
J2#1 = usb a small: UJ2-AV-1-SMT usb a vertical  small; MF: {'manufacturer': u'CUI Devices'}; Package: None; Value: *; Availability: Unavailable; MP: UJ2-AV-1-SMT; Price: None
J4 J6 = SOLDERJUMPER: SMD Solder JUMPERSolder the two pads together to create a connection, or remove the solder to break it.REFLOW - Use this footprint for solder paste and reflow ovens.WAVE - Use this footprint for hand-soldering (larger pads). CLOSED - Has a trace between the two pads to ensure it is closed by default.  The trace needs to be cut to disable the jumper, and can be closed again by creating a solder bridge between the two pads.; GateName_1: 1; BOM: EXCLUDE; SymbolName_1: SOLDERJUMPER; LibraryName: microbuilder; DeviceSetName: SOLDERJUMPER
J15 = Audio Jack _ SJ2-3574A-SMT-TR: 3.5 mm, Stereo, Right Angle, Surface Mount _SMT_, Audio Jack Connector; MF: CUI Devices; Package: None; Value: *; Availability: Unavailable; SnapEDA_Link: https://www.snapeda.com/parts/SJ2-3574A-SMT-TR/CUI%20Devices/view-part/648175/?ref=snap; Price: None; MP: SJ2-3574A-SMT-TR
L28 L29 = INDUCTOR_SMD: Inductor smd; MP: DR127-330-R; MF: Eaton; Price: None; Package: Nonstandard Eaton; Availability: Unavailable; SnapEDA_Link: https://www.snapeda.com/parts/DR127-330-R/Eaton/view-part/?ref=snap; Value: *
LD6 = LED_blue: LED, Blue, 0603; Manuf_1: everlight; Manuf_Part_1: 19-213-R6C-AP1Q2B/3T; ECCN_US/EU: EAR99/NEC; Order: 19-213-R6C-AP1Q2B/3T
P2 = Header 4: Header, 4-Pin; LatestRevisionDate: 17-Jul-2002; LatestRevisionNote: Re-released for DXP Platform.; Publisher: Altium Limited
R31#1 R33#1 R49 R50 R65 = Res 0603: Resistor 0603; Published: 8-Jun-2000; LatestRevisionDate: 29-May-2009; LatestRevisionNote: IPC-7351 Footprint Added.; PackageReference: J1-0603; Publisher: Altium Limited; PackageDescription: Chip Resistor
  R31#1 R33#1: Value: *
T1 = SMAJ3.3A: one side TVS Diode; MP: EDZV12B; MF: ROHM Semiconductor; Price: None; Package: None; SnapEDA_Link: https://www.snapeda.com/parts/EDZV12B/EMI/view-part/4479349/?ref=snap; Availability: Unavailable; Value: *
U1 = JL7016C: BlE Chip
Y1 = crystal b: 13MHz Â±30ppm Crystal 20pF 60 Ohms HC-49/US  ECS-130-20-3X-TR; MF: ECS Inc.; Value: *; SnapEDA_Link: https://www.snapeda.com/parts/ECS-130-20-3X-TR/ECS%20Inc./view-part/2459108/?ref=snap; MP: ECS-130-20-3X-TR; Check_prices: https://www.snapeda.com/parts/ECS-130-20-3X-TR/ECS%20Inc./view-part/2459108/?ref=eda; Purchase-URL: https://pricing.snapeda.com/search/part/ECS-130-20-3X-TR/?ref=eda; Availability: Warning; Price: None; Package: HC49/US ECS International

## Sheet POWER.SchDoc
size A3
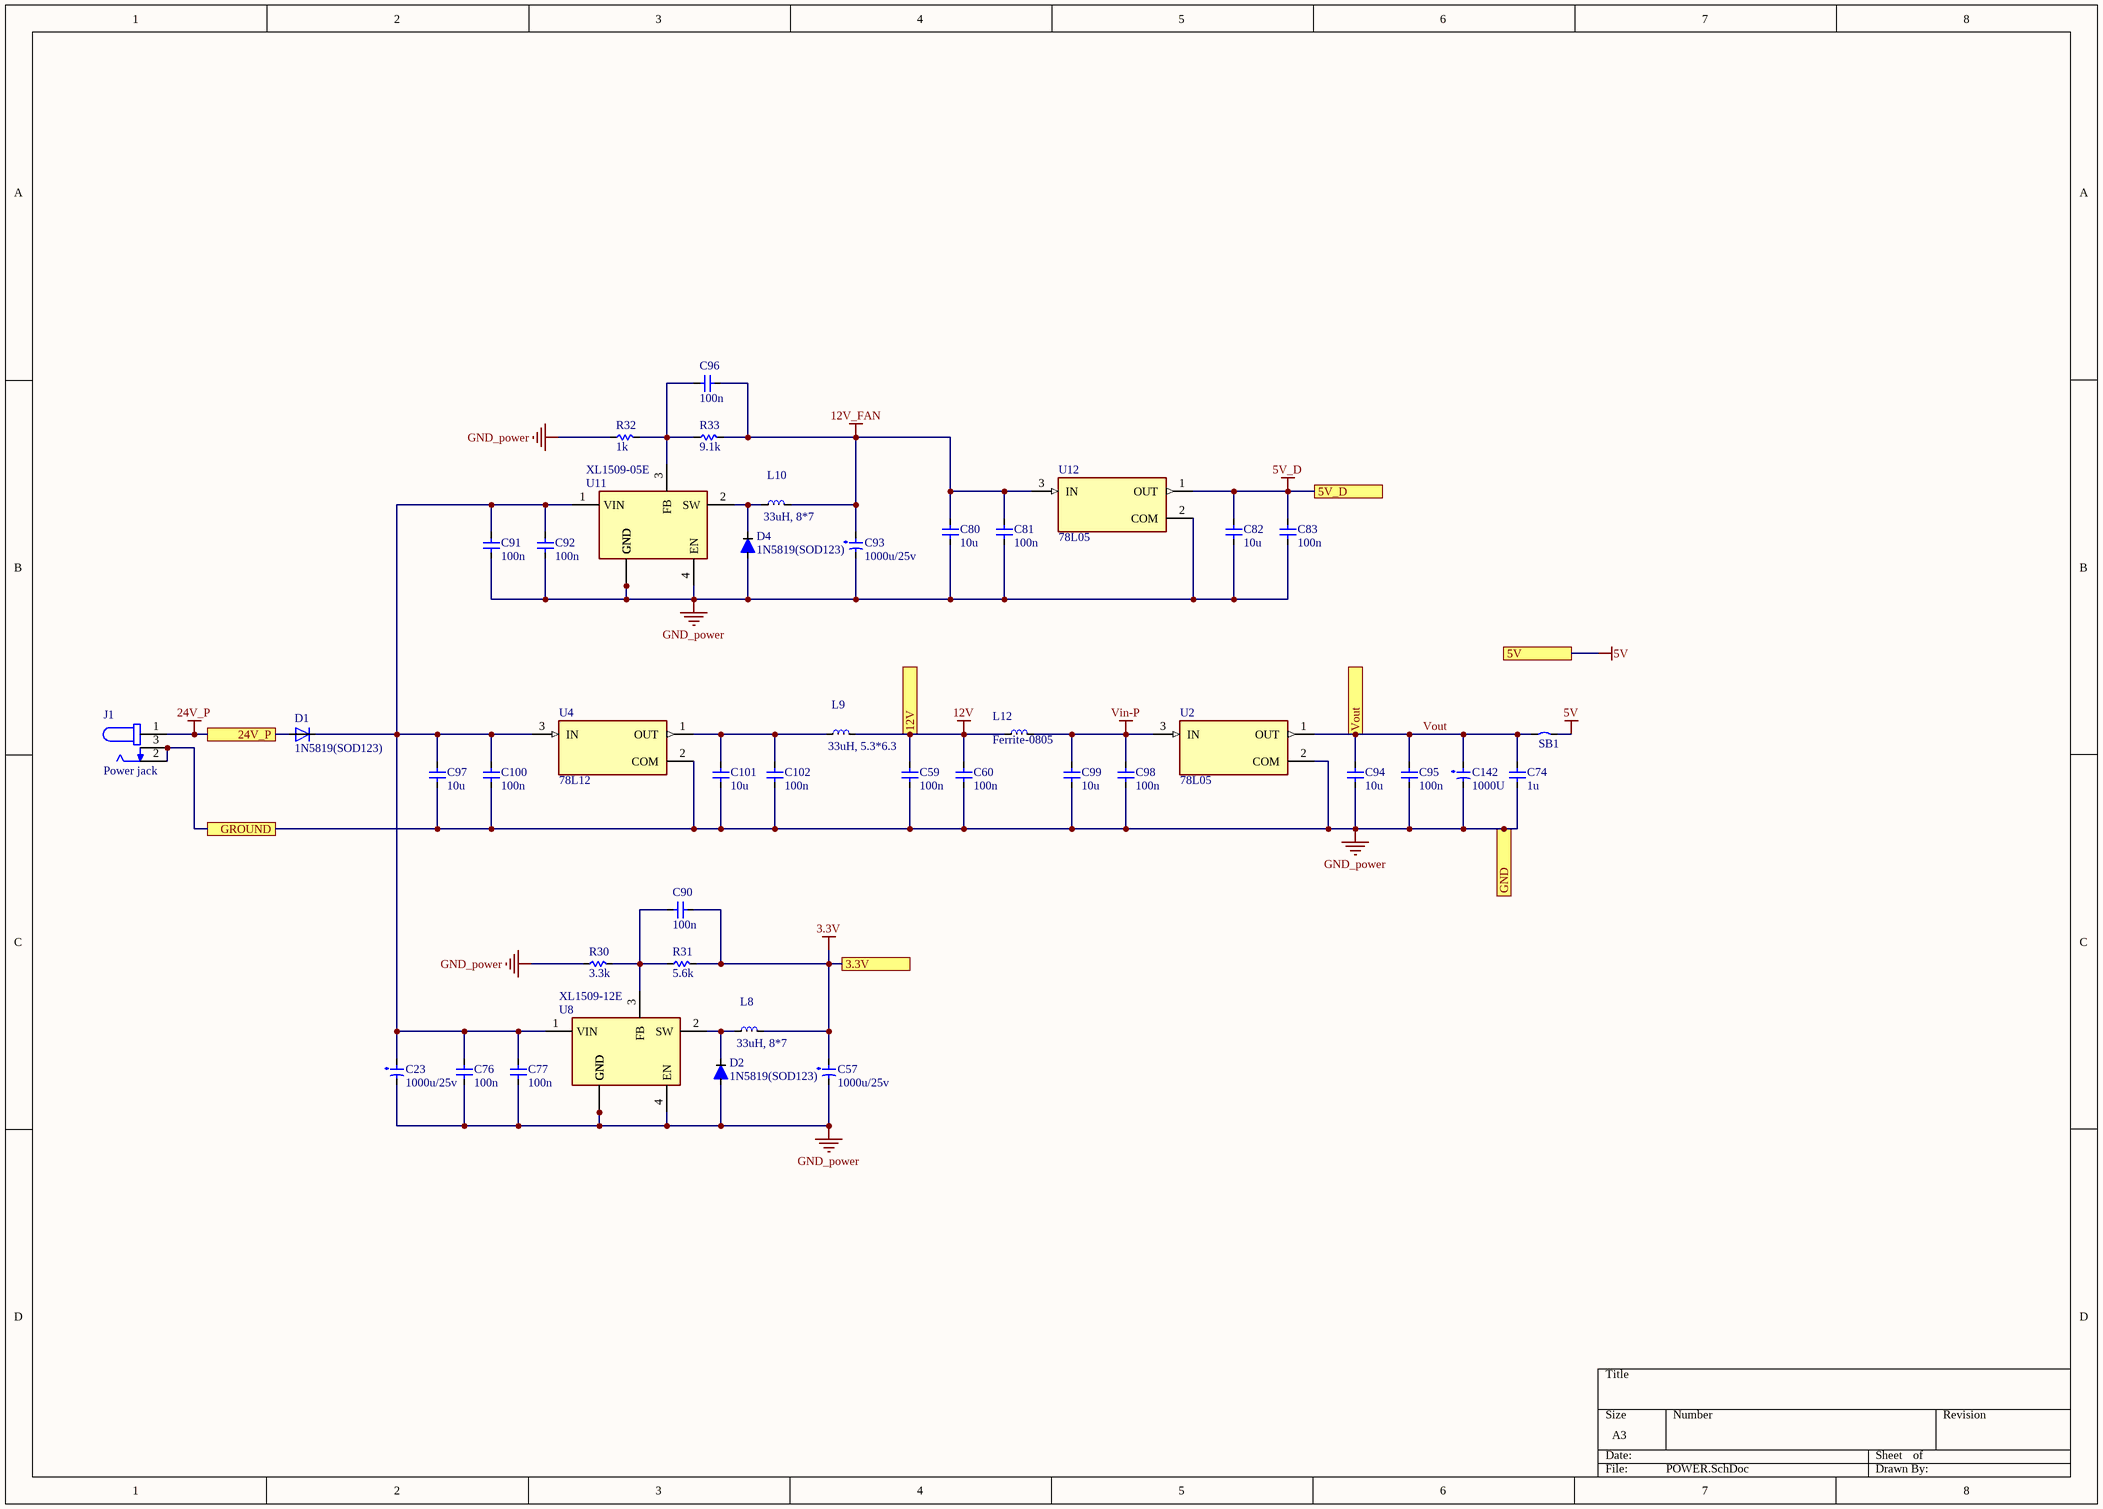
[diagram p7: POWER.SchDoc]

### Parts
(Parts that share a designator on the sheet are numbered #1, #2 ... from top to bottom, then left to right.)
C23  1000u/25v  [CAP DIP 10*13]
C57  1000u/25v  [CAP DIP 10*13]
C59  100n  [cap0603]
C60  100n  [cap0603]
C74  1u  [cap0603]
C76  100n  [cap0603]
C77  100n  [cap0603]
C80  10u  [CAP 0805]
C81  100n  [cap0603]
C82  10u  [CAP 0805]
C83  100n  [cap0603]
C90  100n  [cap0603]
C91  100n  [cap0603]
C92  100n  [cap0603]
C93  1000u/25v  [CAP DIP 10*13]
C94  10u  [CAP 0805]
C95  100n  [cap0603]
C96  100n  [cap0603]
C97  10u  [CAP 0805]
C98  100n  [cap0603]
C99  10u  [CAP 0805]
C100  100n  [cap0603]
C101  10u  [CAP 0805]
C102  100n  [cap0603]
C142  1000U  [cap  dip 10*20]
D1  1N5819(SOD123)  [1N5819 SOD-123]
D2  1N5819(SOD123)  [1N5819 SOD-123]
D4  1N5819(SOD123)  [1N5819 SOD-123]
J1  Power jack  [Power jack]
L8  33uH, 8*7  [Inductor 8*7]
L9  33uH, 5.3*6.3  [Inductor SMD 5.3x6.3mm]
L10  33uH, 8*7  [Inductor 8*7]
L12  Ferrite-0805  [Ferrite-0805]
R30  3.3k  [RES-0603]
R31#2  5.6k  [RES-0603]
R32  1k  [RES-0603]
R33#2  9.1k  [RES-0603]
SB1  jumper  [JP2_SMD]  (value not drawn)
U2  78L05  [78L05]
U4  78L12  [78L05]
U8  XL1509-12E  [FR9886]
U11  XL1509-05E  [FR9886]
U12  78L05  [78L05]

### Ports
3.3V, 5V, 5V_D, 12V, 24V_P, GND, GROUND, Vout

### Nets
3.3V: C57.1(POS) C90.1 L8.1 R31#2.2 ; port 3.3V
5V: SB1.2 ; port 5V  [project net VPWR]
5V_D: C82.2 C83.2 U12.1(OUT) ; port 5V_D
12V: C59.2 C60.2 L9.1 L12.2 ; port 12V
12V_FAN: C80.2 C81.2 C93.1(POS) C96.1 L10.1 R33#2.2 U12.3(IN)
24V_P: D1.2(A) J1.1 ; port 24V_P
GND_power: C23.2(NEG) C57.2(NEG) C59.1 C60.1 C74.1 C76.1 C77.1 C80.1 C81.1 C82.1 C83.1 C91.1 C92.1 C93.2(NEG) C94.1 C95.1 C97.1 C98.1 C99.1 C100.1 C101.1 C102.1 C142.2(NEG) D2.2(C) D4.2(C) J1.2 J1.3 R30.1 R32.1 U2.2(COM) U4.2(COM) U8.4(EN) U8.5(GND) U8.6(GND) U8.7(GND) U8.8(GND) U11.4(EN) U11.5(GND) U11.6(GND) U11.7(GND) U11.8(GND) U12.2(COM) ; port GND, port GROUND  [project net GND]
Vin-P: C98.2 C99.2 L12.1 U2.3(IN)
Vout: C74.2 C94.2 C95.2 C142.1(POS) SB1.1 U2.1(OUT) ; port Vout
NetC23_1: C23.1(POS) C76.2 C77.2 C91.2 C92.2 C97.2 C100.2 D1.1(K) U4.3(IN) U8.1(VIN) U11.1(VIN)
NetC90_2: C90.2 R30.2 R31#2.1 U8.3(FB)
NetC96_2: C96.2 R32.2 R33#2.1 U11.3(FB)
NetC101_2: C101.2 C102.2 L9.2 U4.1(OUT)
NetD2_1: D2.1(A) L8.2 U8.2(SW)
NetD4_1: D4.1(A) L10.2 U11.2(SW)

### Library data of the parts
C23 C57 C93 = capacitor dip 10*13: as C14 on sheet Amplifier; Package: Radial Nichicon; Value: *; Price: None; SnapEDA_Link: https://www.snapeda.com/parts/UVZ1H222MHD/Nichicon/view-part/468437/?ref=snap; Availability: Unavailable
C59 C60 C74 C76 C77 C81 C83 C90-C92 C95 C96 C98 C100 C102 = Cap 0603: Capacitor 0603; Value: 104; Published: 8-Jun-2000; LatestRevisionDate: 17-Jul-2002; LatestRevisionNote: Re-released for DXP Platform.; Publisher: Altium Limited
C80 C82 C94 C97 C99 C101 = Cap 0805: Capacitor 0805; Value: 104; Published: 8-Jun-2000; LatestRevisionDate: 17-Jul-2002; LatestRevisionNote: Re-released for DXP Platform.; Publisher: Altium Limited
C142 = capacitor dip 10*20: 2200ÂµF 50V Aluminum Electrolytic Capacitors Radial, Can 1000 Hrs @ 105Â°C; MF: Nichicon; MP: UVZ1H222MHD; Package: Radial Nichicon; Value: *; Price: None; SnapEDA_Link: https://www.snapeda.com/parts/UVZ1H222MHD/Nichicon/view-part/468437/?ref=snap; Availability: Unavailable
D1 D2 D4 = 1N5819(SOD123): Shotkey diod SOD-123; MP: BAS716; MF: Nexperia USA; SnapEDA_Link: https://www.snapeda.com/parts/BAS716/Nexperia%20USA%20Inc./view-part/143287/?ref=snap; Price: None; Package: SOD-523 NXP Semiconductors; Arrow_Electronics-Purchase-URL: https://snapeda.com/shop?store=Arrow+Electronics&id=143287; Value: *; Availability: Unavailable
J1 = Power jack: 2.0 x 6.5 mm, 2.5 A, Horizontal, Through Hole, Tapered Pins, Dc Power Jack Connector; MF: CUI Devices; MP: PJ-102A; CUI_purchase_URL: https://www.cuidevices.com/product/interconnect/connectors/dc-power-connectors/jacks/pj-102a?utm_source=snapeda.com&utm_medium=referral&utm_campaign=snapedaBOM; Price: None; SnapEDA_Link: https://www.snapeda.com/parts/PJ-102A/CUI%20Devices/view-part/55545/?ref=snap; Value: *; Availability: Unavailable; Package: None
L8 L10 = INDUCTOR 8*7: Inductor round 8*7; MP: DR127-330-R; MF: Eaton; Price: None; Package: Nonstandard Eaton; Availability: Unavailable; SnapEDA_Link: https://www.snapeda.com/parts/DR127-330-R/Eaton/view-part/?ref=snap; Value: *
L9 = INDUCTOR 5.3*6.3: Inductor round 5.3*6.3; MP: DR127-330-R; MF: Eaton; Price: None; Package: Nonstandard Eaton; Availability: Unavailable; SnapEDA_Link: https://www.snapeda.com/parts/DR127-330-R/Eaton/view-part/?ref=snap; Value: *
L12 = Ferrite _0805: as L1 on sheet Amplifier; Package: 0603 Murata; Price: None; Availability: Unavailable; SnapEDA_Link: https://www.snapeda.com/parts/BLM18BB331SN1D/Murata%20Electronics%20North%20America/view-part/?ref=snap; Value: *
R30 R31#2 R32 R33#2 = Res 0603: Resistor 0603; Published: 8-Jun-2000; LatestRevisionDate: 29-May-2009; LatestRevisionNote: IPC-7351 Footprint Added.; PackageReference: J1-0603; Publisher: Altium Limited; PackageDescription: Chip Resistor
SB1 = jumper: Circuit Breaker; Solder: NO; Revision: July-2002: Re-released for DXP Platform.
U2 U4 U12 = 78L05: Linear Voltage Regulator IC 1 Output 100mA SOT-89-3; MP: UA78L05CPK; MF: Texas Instruments; Availability: Unavailable; Package: SOT-89-3 Texas Instruments; SnapEDA_Link: https://www.snapeda.com/parts/UA78L05CPK/Texas%20Instruments/view-part/512891/?ref=snap; Value: *; Price: None
U8 U11 = XL1509-12E: Regulator SOP-8; Manufacturer_Name: Fitipower; Manufacturer_Part_Number: FR9886SOGTR; Datasheet Link: https://www.insidegadgets.com/wp-content/uploads/2015/03/FR9886.pdf; Height: 1.75mm

## Sheet TouchORkey.SchDoc
size A2
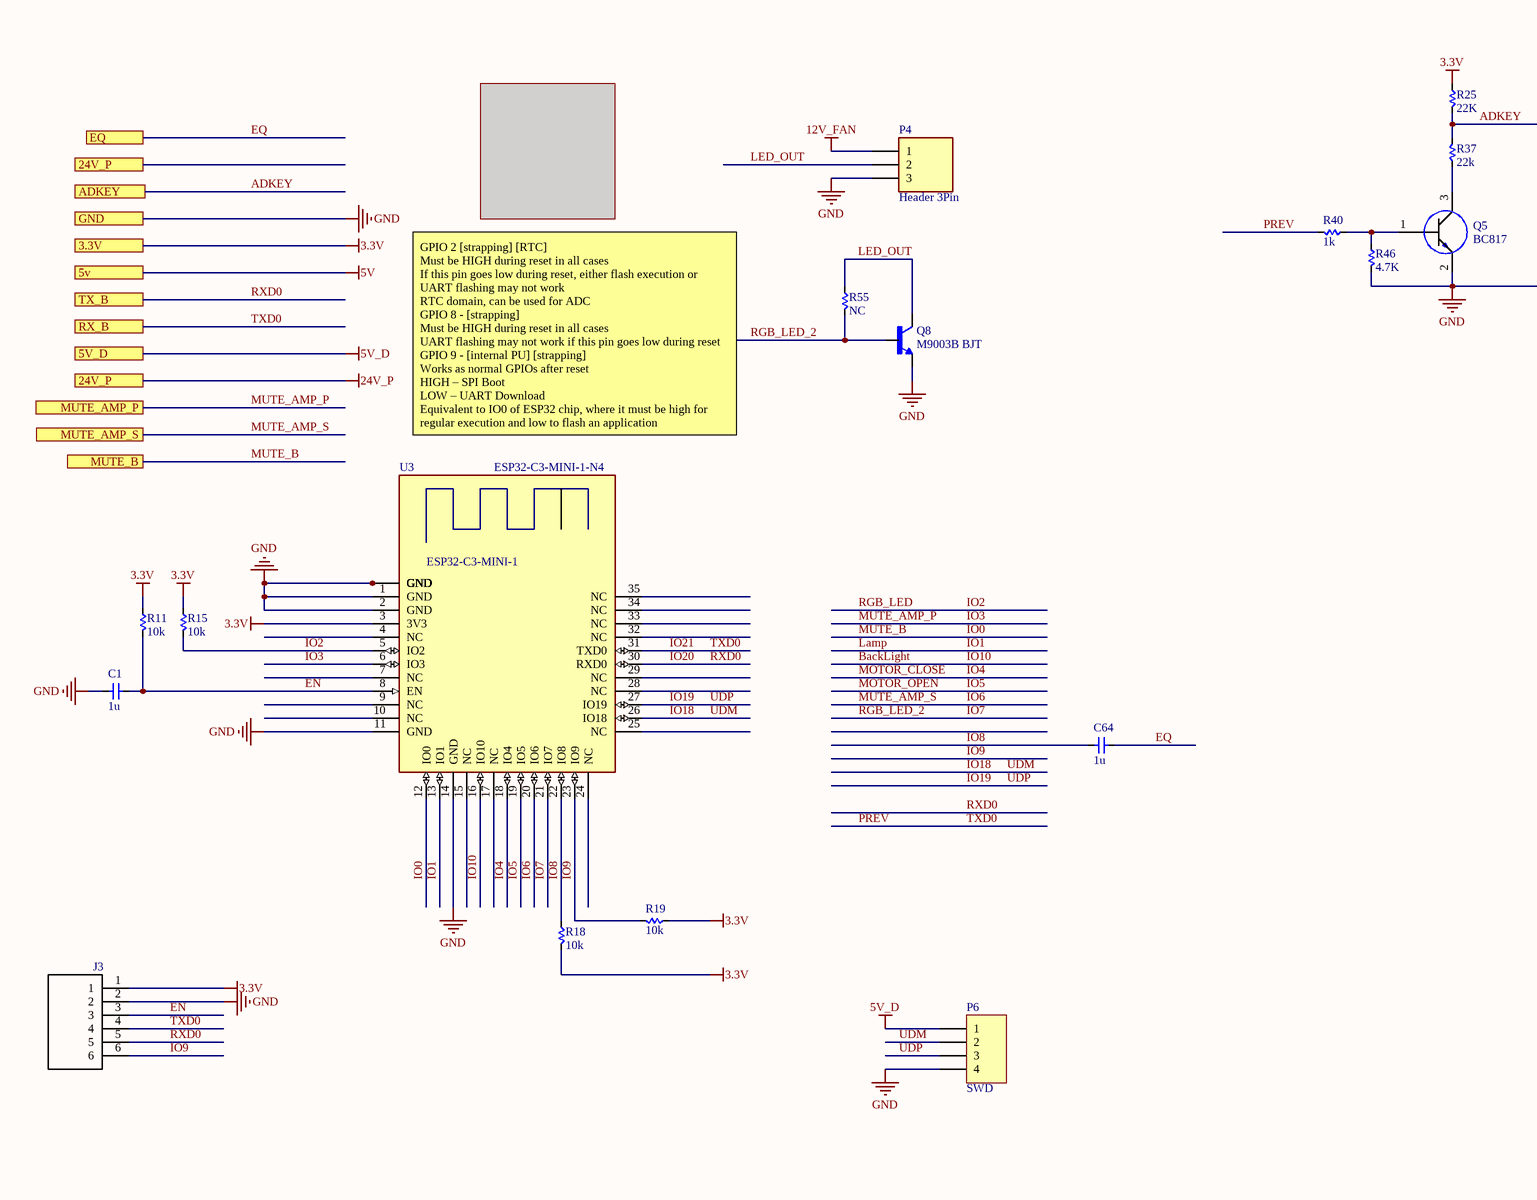
[diagram p8: TouchORkey.SchDoc, left]
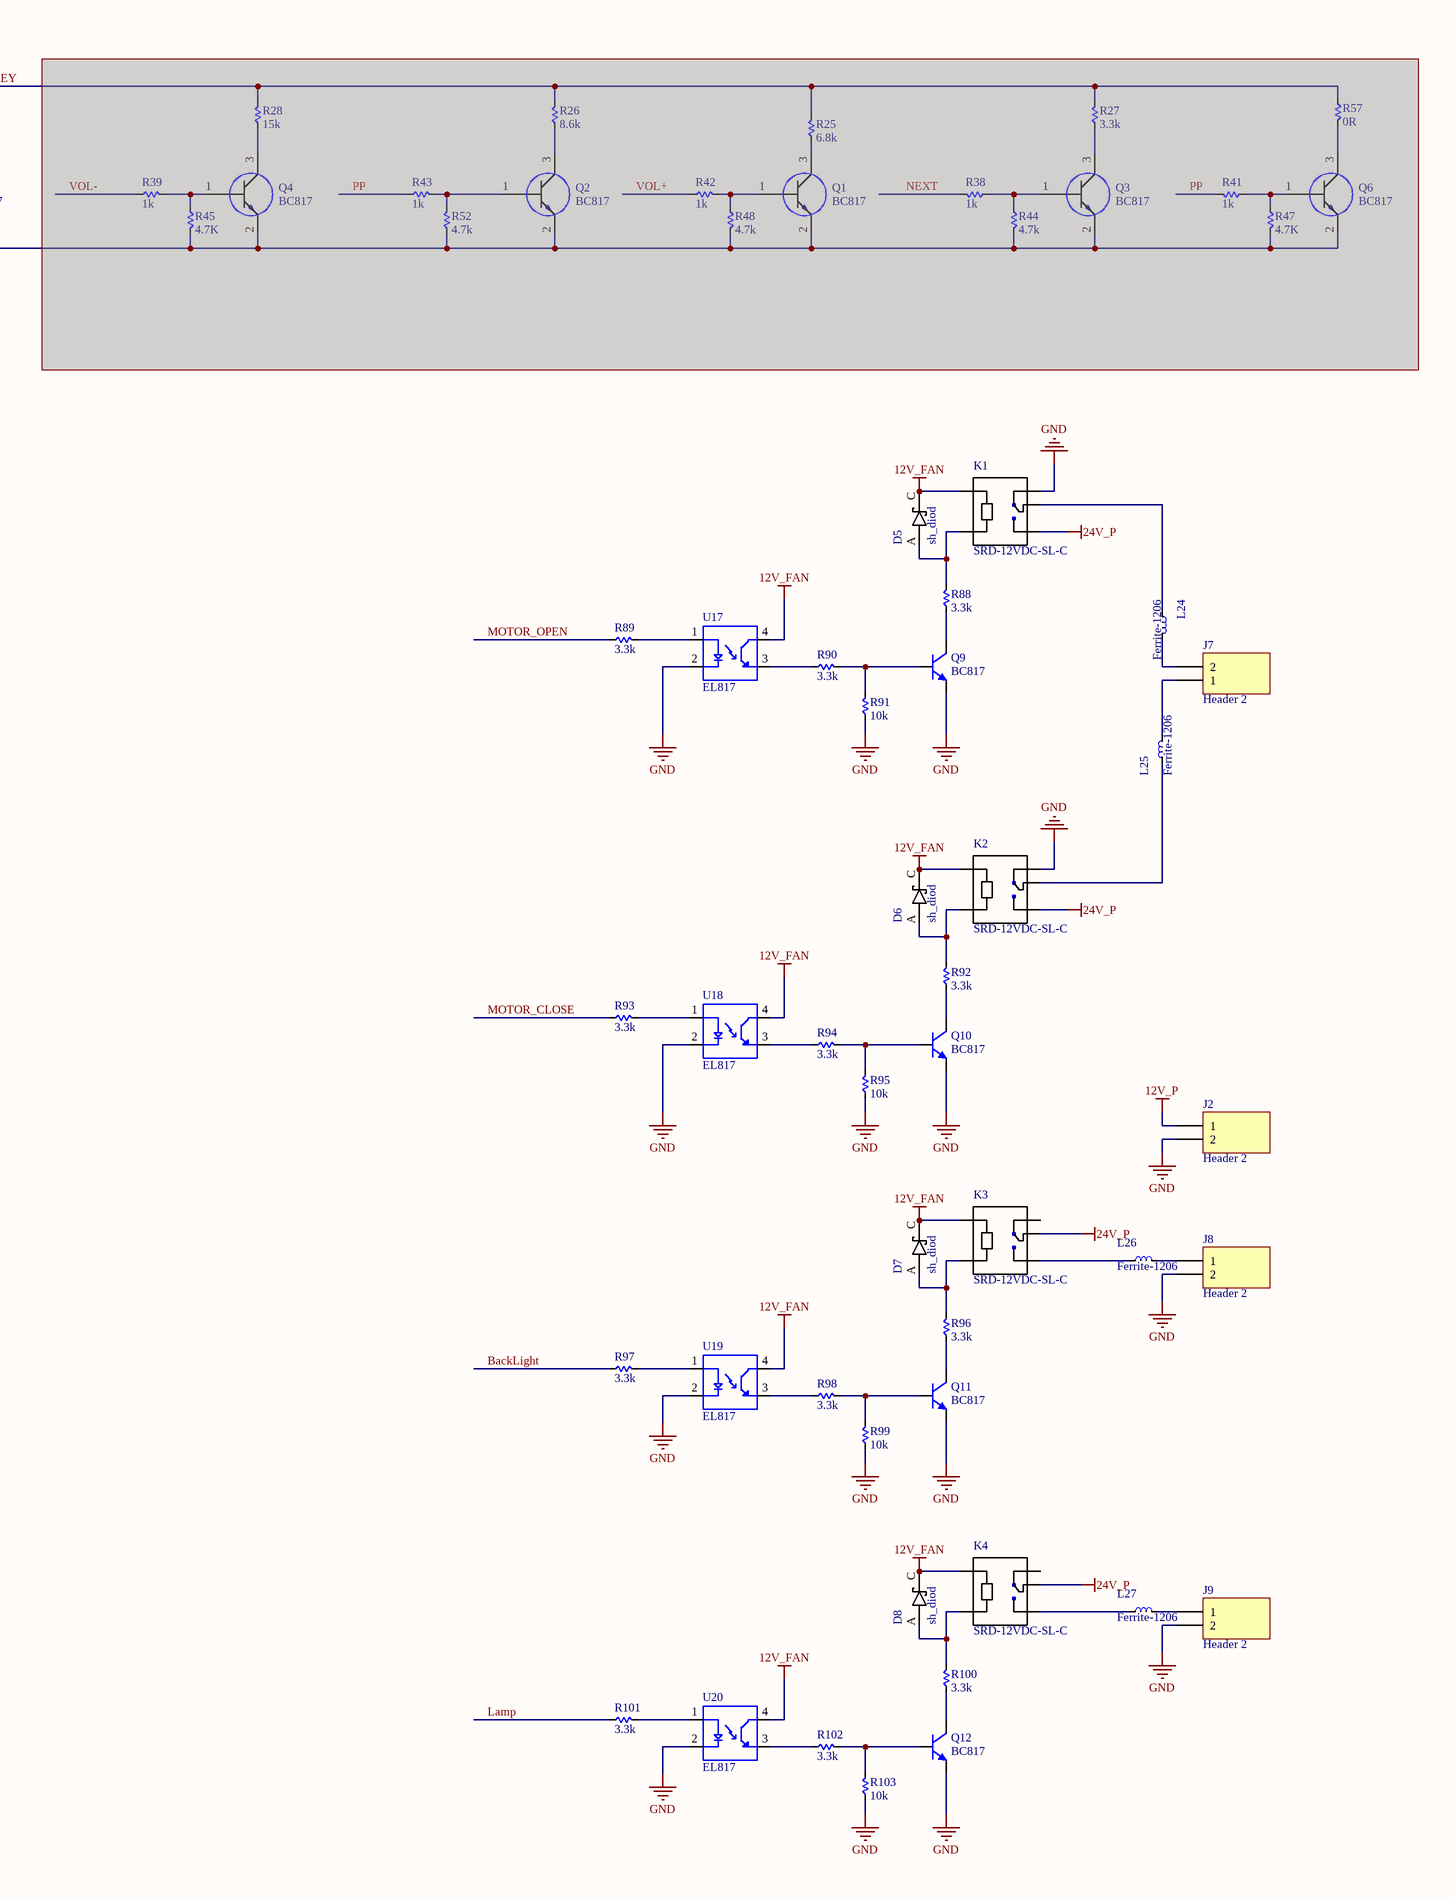
[diagram p9: TouchORkey.SchDoc, right]

### Parts
(Parts that share a designator on the sheet are numbered #1, #2 ... from top to bottom, then left to right.)
C1  1u  [cap0603]
C64#2  1u  [cap0603]
D5  sh_diod  [SH_diod]
D6  sh_diod  [SH_diod]
D7  sh_diod  [SH_diod]
D8  sh_diod  [SH_diod]
J2#2  Header 2  [CONN-PHOENIX-5.08]
J3  NC  [pin header1*6]  (value not drawn)
J7  Header 2  [CONN-PHOENIX-5.08]
J8  Header 2  [CONN-PHOENIX-5.08]
J9  Header 2  [CONN-PHOENIX-5.08]
K1  SRD-12VDC-SL-C  [RELAY_SRD-05VDC-SL-C_SRD-05VDC-SL-C(Primary)]
K2  SRD-12VDC-SL-C  [RELAY_SRD-05VDC-SL-C_SRD-05VDC-SL-C(Primary)]
K3  SRD-12VDC-SL-C  [RELAY_SRD-05VDC-SL-C_SRD-05VDC-SL-C(Primary)]
K4  SRD-12VDC-SL-C  [RELAY_SRD-05VDC-SL-C_SRD-05VDC-SL-C(Primary)]
L24  Ferrite-1206  [FERRITE 1206]
L25  Ferrite-1206  [FERRITE 1206]
L26  Ferrite-1206  [FERRITE 1206]
L27  Ferrite-1206  [FERRITE 1206]
P4  Header 3Pin  [CONN-PHOENIX-3.81 3Pin]
P6  SWD  [HDR1X4H]
Q1  BC817  [BJT SS805]  (masked out: inside a compile mask, not in the netlist)
Q2  BC817  [BJT SS805]  (masked out: inside a compile mask, not in the netlist)
Q3  BC817  [BJT SS805]  (masked out: inside a compile mask, not in the netlist)
Q4  BC817  [BJT SS805]  (masked out: inside a compile mask, not in the netlist)
Q5  BC817  [BJT SS805]
Q6  BC817  [BJT SS805]  (masked out: inside a compile mask, not in the netlist)
Q8  M9003B BJT  [M9003 BJT]
Q9  BC817  [BC817]
Q10  BC817  [BC817]
Q11  BC817  [BC817]
Q12  BC817  [BC817]
R11  10k  [RES-0603]
R15  10k  [RES-0603]
R18  10k  [RES-0603]
R19  10k  [RES-0603]
R25#1  22K  [RES-0603]
R25#2  6.8k  [RES-0603]  (masked out: inside a compile mask, not in the netlist)
R26  8.6k  [RES-0603]  (masked out: inside a compile mask, not in the netlist)
R27  3.3k  [RES-0603]  (masked out: inside a compile mask, not in the netlist)
R28  15k  [RES-0603]  (masked out: inside a compile mask, not in the netlist)
R37  22k  [RES-0603]
R38  1k  [RES-0603]  (masked out: inside a compile mask, not in the netlist)
R39  1k  [RES-0603]  (masked out: inside a compile mask, not in the netlist)
R40  1k  [RES-0603]
R41  1k  [RES-0603]  (masked out: inside a compile mask, not in the netlist)
R42  1k  [RES-0603]  (masked out: inside a compile mask, not in the netlist)
R43  1k  [RES-0603]  (masked out: inside a compile mask, not in the netlist)
R44  4.7k  [RES-0603]  (masked out: inside a compile mask, not in the netlist)
R45  4.7K  [RES-0603]  (masked out: inside a compile mask, not in the netlist)
R46  4.7K  [RES-0603]
R47  4.7K  [RES-0603]  (masked out: inside a compile mask, not in the netlist)
R48  4.7k  [RES-0603]  (masked out: inside a compile mask, not in the netlist)
R52  4.7k  [RES-0603]  (masked out: inside a compile mask, not in the netlist)
R55  NC  [RES-0603]
R57  0R  [RES-0603]  (masked out: inside a compile mask, not in the netlist)
R88  3.3k  [RES-0603]
R89  3.3k  [RES-0603]
R90  3.3k  [RES-0603]
R91  10k  [RES-0603]
R92  3.3k  [RES-0603]
R93  3.3k  [RES-0603]
R94  3.3k  [RES-0603]
R95  10k  [RES-0603]
R96  3.3k  [RES-0603]
R97  3.3k  [RES-0603]
R98  3.3k  [RES-0603]
R99  10k  [RES-0603]
R100  3.3k  [RES-0603]
R101  3.3k  [RES-0603]
R102  3.3k  [RES-0603]
R103  10k  [RES-0603]
U3  ESP32-C3-MINI-1-N4  [ESP32-C3-MINI-1]
U17  EL817  [EL817]
U18  EL817  [EL817]
U19  EL817  [EL817]
U20  EL817  [EL817]

### Ports
3.3V, 5v, 5V_D, 24V_P, ADKEY, EQ, GND, MUTE_AMP_P, MUTE_AMP_S, MUTE_B, RX_B, TX_B

### Nets
3.3V: J3.1 R11.1 R15.1 R18.2 R19.1 R25#1.1 U3.3(3V3) ; port 3.3V
5V_D: P6.1 ; port 5V_D
12V_FAN: D5.C(K) D6.C(K) D7.C(K) D8.C(K) K1.A1 K2.A1 K3.A1 K4.A1 P4.1 U17.4(CT) U18.4(CT) U19.4(CT) U20.4(CT)
12V_P: J2#2.1
24V_P: K1.NO K2.NO K3.COM K4.COM ; port 24V_P
GND: C1.1 J2#2.2 J3.2 J8.2 J9.2 K1.NC K2.NC P4.3 P6.4 Q5.2(E) Q8.2(C) Q9.2(E) Q10.2(E) Q11.2(E) Q12.2(E) R46.2 R91.1 R95.1 R99.1 R103.1 U3.1(GND) U3.2(GND) U3.11(GND) U3.14(GND) U3.36(GND) U3.37(GND) U3.38(GND) U3.39(GND) U3.40(GND) U3.41(GND) U3.42(GND) U3.43(GND) U3.44(GND) U3.45(GND) U3.46(GND) U3.47(GND) U3.48(GND) U3.49_1(GND) U3.49_2(GND) U3.49_3(GND) U3.49_4(GND) U3.49_5(GND) U3.49_6(GND) U3.49_7(GND) U3.49_8(GND) U3.49_9(GND) U3.50(GND) U3.51(GND) U3.52(GND) U3.53(GND) U17.2(C) U18.2(C) U19.2(C) U20.2(C) ; port GND
ADKEY: R25#1.2 R37.2 ; port ADKEY
BackLight: R97.1 U3.16(IO10)  [also labelled IO10]
EN: C1.2 J3.3 R11.2 U3.8(EN)
EQ: C64#2.2 ; port EQ
IO0: U3.12(IO0) ; port MUTE_B  [also labelled MUTE_B]
IO1: R101.1 U3.13(IO1)  [also labelled Lamp]
IO2: R15.2 U3.5(IO2)  [also labelled RGB_LED]
IO3: U3.6(IO3) ; port MUTE_AMP_P  [also labelled MUTE_AMP_P]
IO4: R93.1 U3.18(IO4)  [also labelled MOTOR_CLOSE]
IO5: R89.1 U3.19(IO5)  [also labelled MOTOR_OPEN]
IO6: U3.20(IO6) ; port MUTE_AMP_S  [also labelled MUTE_AMP_S]
IO7: Q8.1(B) R55.2 U3.21(IO7)  [also labelled RGB_LED_2]
IO8: C64#2.1 R18.1 U3.22(IO8)
IO9: J3.6 R19.2 U3.23(IO9)
IO18: P6.2 U3.26(IO18)  [also labelled UDM]
IO19: P6.3 U3.27(IO19)  [also labelled UDP]
IO20: J3.5 U3.30(RXD0) ; port TX_B  [also labelled RXD0]
IO21: J3.4 R40.2 U3.31(TXD0) ; port RX_B  [also labelled PREV, TXD0]
LED_OUT: P4.2 Q8.3(E) R55.1
NetD5_A: D5.A K1.A2 R88.2
NetD6_A: D6.A K2.A2 R92.2
NetD7_A: D7.A K3.A2 R96.2
NetD8_A: D8.A K4.A2 R100.2
NetJ7_1: J7.1 L25.1
NetJ7_2: J7.2 L24.1
NetJ8_1: J8.1 L26.1
NetJ9_1: J9.1 L27.1
NetK1_COM: K1.COM L24.2
NetK2_COM: K2.COM L25.2
NetK3_NO: K3.NO L26.2
NetK4_NO: K4.NO L27.2
NetQ5_1: Q5.1(B) R40.1 R46.1
NetQ5_3: Q5.3(C) R37.1
NetQ9_1: Q9.1(B) R90.2 R91.2
NetQ9_3: Q9.3(C) R88.1
NetQ10_1: Q10.1(B) R94.2 R95.2
NetQ10_3: Q10.3(C) R92.1
NetQ11_1: Q11.1(B) R98.2 R99.2
NetQ11_3: Q11.3(C) R96.1
NetQ12_1: Q12.1(B) R102.2 R103.2
NetQ12_3: Q12.3(C) R100.1
NetR89_2: R89.2 U17.1(A)
NetR90_1: R90.1 U17.3(ET)
NetR93_2: R93.2 U18.1(A)
NetR94_1: R94.1 U18.3(ET)
NetR97_2: R97.2 U19.1(A)
NetR98_1: R98.1 U19.3(ET)
NetR101_2: R101.2 U20.1(A)
NetR102_1: R102.1 U20.3(ET)

Not connected (* = marked no-connect by the designer): K3 NC; K4 NC; U3 4(NC) 7(NC) 9(NC) 10(NC) 15(NC) 17(NC) 24(NC) 25(NC) 28(NC) 29(NC) 32(NC) 33(NC) 34(NC) 35(NC)

### Notes on the sheet
- GPIO 2 [strapping] [RTC]
  Must be HIGH during reset in all cases
  If this pin goes low during reset, either flash execution or UART flashing may not work
  RTC domain, can be used for ADC
  GPIO 8 - [strapping]
  Must be HIGH during reset in all cases
  UART flashing may not work if this pin goes low during reset
  GPIO 9 - [internal PU] [strapping]
  Works as normal GPIOs after reset
  HIGH – SPI Boot
  LOW – UART Download
  Equivalent to IO0 of ESP32 chip, where it must be high for regular execution and low to flash an application
- (in symbol ESP32-C3-MINI-1-N4) ESP32-C3-MINI-1

### Library data of the parts
C1 C64#2 = Cap 0603: Capacitor 0603; Value: 104; Published: 8-Jun-2000; LatestRevisionDate: 17-Jul-2002; LatestRevisionNote: Re-released for DXP Platform.; Publisher: Altium Limited
D5-D8 = sh_diod: MF: ON Semiconductor; MP: SS34; Package: None; Price: None; Availability: Unavailable; SnapEDA_Link: https://www.snapeda.com/parts/SS34/ON%20Semiconductor/view-part/4479478/?ref=snap; Value: *
J2#2 J7-J9 = CONN-Phoenix-5.08: Phoenix Connector 5.08; LatestRevisionDate: 17-Jul-2002; LatestRevisionNote: Re-released for DXP Platform.; Publisher: Altium Limited
J3 = pin header 06: Pin Connector 06 MODII HDR SRST B/A .100CL 6 POS; MF: TE Connectivity; MP: 5-146283-6; Price: None; SnapEDA_Link: https://www.snapeda.com/parts/5-146283-6/TE%20Connectivity%20AMP%20Connectors/view-part/?ref=snap; Availability: Unavailable; TE_purchase_URL: https://www.te.com/usa-en/product-5-146283-6.html?te_bu=Cor&te_type=disp&te_campaign=seda_glo_cor-seda-global-disp-prtnr-fy19-seda-model-bom-cta_sma-317_1&elqCampaignId=32493; Package: None; Value: *
K1-K4 = RELAY-SRD: 5V Trigger Relay Module For Arduino And Raspberry Pi 5V Trigger Relay Module For Arduino And Raspberry Pi; MP: SRD-05VDC-SL-C; MF: Songle Relay; SnapEDA_Link: https://www.snapeda.com/parts/SRD-05VDC-SL-C/Songle%20Relay/view-part/1029484/?ref=snap; Availability: Unavailable; Price: None; Package: None; Value: *
L24-L27 = Ferrite _1206: BLM Series 1206 330 Ohm 400 mA 0.58 Ohm DCR Surface Mount Ferrite Bead; MF: Murata; MP: BLM18BB331SN1D; Package: 0603 Murata; Price: None; Availability: Unavailable; SnapEDA_Link: https://www.snapeda.com/parts/BLM18BB331SN1D/Murata%20Electronics%20North%20America/view-part/?ref=snap; Value: *
P4 = CONN-Phoenix-3.81 3Pin: Phoenix Connector 3.81; LatestRevisionDate: 17-Jul-2002; LatestRevisionNote: Re-released for DXP Platform.; Publisher: Altium Limited
P6 = pin header 1X4: Header, 4-Pin; LatestRevisionDate: 17-Jul-2002; LatestRevisionNote: Re-released for DXP Platform.; Publisher: Altium Limited
Q1-Q6 = SS8050-G BJT_ Transistor: Bipolar _BJT_ Transistor NPN 25V 1.5A 100MHz 300mW Surface Mount SOT-23; MF: Comchip Technology; SnapEDA_Link: https://www.snapeda.com/parts/SS8050-G/Comchip%20Technology/view-part/809142/?ref=snap; Price: None; MP: SS8050-G; Package: TO-236 Comchip; Availability: Unavailable; Value: *
Q8 = M9003B: Bipolar (BJT) Transistor NPN TO-252, (D-Pak); MF: Diodes Inc.; MP: 2DB1184Q-13; SnapEDA_Link: https://www.snapeda.com/parts/2DB1184Q-13/Diodes+Inc./view-part/?ref=snap; Package: TO-252-3 Diodes Inc.; Value: *; Check_prices: https://www.snapeda.com/parts/2DB1184Q-13/Diodes+Inc./view-part/?ref=eda
Q9-Q12 = BC817: NPN General Purpose Amplifier BJT; Published: 8-Jun-2000; LatestRevisionDate: 15-Jan-2003; LatestRevisionNote: PCB Footprint 'BCY-W3/D4.7' replaced; DatasheetVersion: 1997; PackageVersion: Sep-1998; PackageReference: TO-92A; Publisher: Altium Limited; PackageDescription: TO, Flat Index; 3 In-Line, Axial Leads; Body Dia. 4.5mm; Leads 0.51 x 0.48 mm (max); ComponentLink1Description: Manufacturer Link; ComponentLink1URL: http://www.fairchildsemi.com/; ComponentLink2Description: Datasheet; ComponentLink2URL: http://www.fairchildsemi.com/ds/2N%2F2N3904.pdf
R11 R15 R18 R19 R25#1 R25#2 R26-R28 R37-R48 R52 R55 R57 R88-R103 = Res 0603: Resistor 0603; Published: 8-Jun-2000; LatestRevisionDate: 29-May-2009; LatestRevisionNote: IPC-7351 Footprint Added.; PackageReference: J1-0603; Publisher: Altium Limited; PackageDescription: Chip Resistor
  R11 R15 R25#1 R25#2 R26-R28 R37-R48 R52 R57: Value: *
U3 = ESP32-C3-MINI-1-N4: MF: {'manufacturer': u'Espressif Systems'}; Package: None; Price: None; Value: *; MP: ESP32-C3-MINI-1-N4; Availability: Unavailable
U17-U20 = EL817(S1)(A)(TU)-G: Optoisoltr 5kv Transistor 4-Smd; Package: None; Price: None; Value: *; MP: EL817(S1)(A)(TU)-G; Availability: Unavailable

## Nets that join several sheets
3.3V: POWER (C57.1 C90.1 L8.1 R31#2.2), TouchORkey (7 pins)
5V_D: POWER (C82.2 C83.2 U12.1), TouchORkey (P6.1)
12V: Amplifier (C7.2 C9.1 IC2.8 R8.2), POWER (C59.2 C60.2 L9.1 L12.2)
12V_FAN: Amplifier (R16.2 R62.2 U6.1 U9.5), POWER (7 pins), TouchORkey (13 pins)
24V_P: Amplifier (51 pins), POWER (D1.2 J1.1), TouchORkey (K1.NO K2.NO K3.COM K4.COM)
AGND: Amplifier (23 pins), Bluetooth (C29.2 U1.31)
GND: Amplifier (92 pins), Bluetooth (12 pins), POWER (42 pins), TouchORkey (54 pins)
VPWR: Bluetooth (C44.1 D3.1 P2.1 U1.9), POWER (SB1.2)
ADKEY: Bluetooth (U1.15), TouchORkey (R25#1.2 R37.2)
DACL: Amplifier (R6.2 R34.2 R76.2 R77.2), Bluetooth (U1.2)
DACR: Amplifier (R29.2 R36.1 R66.2 R69.2), Bluetooth (U1.1)
EQ: Amplifier (C37.2 R6.1 R36.2), TouchORkey (C64#2.2)
IO0: Bluetooth (U1.13), TouchORkey (U3.12)
IO3: Amplifier (R4.1), TouchORkey (U3.6)
IO6: Amplifier (R23.1), TouchORkey (U3.20)
IO20: Bluetooth (J6.1 R50.2), TouchORkey (J3.5 U3.30)
IO21: Bluetooth (J4.1 R49.2), TouchORkey (J3.4 R40.2 U3.31)